# EAGLE design Main_bord (EAGLE 8.6.0)
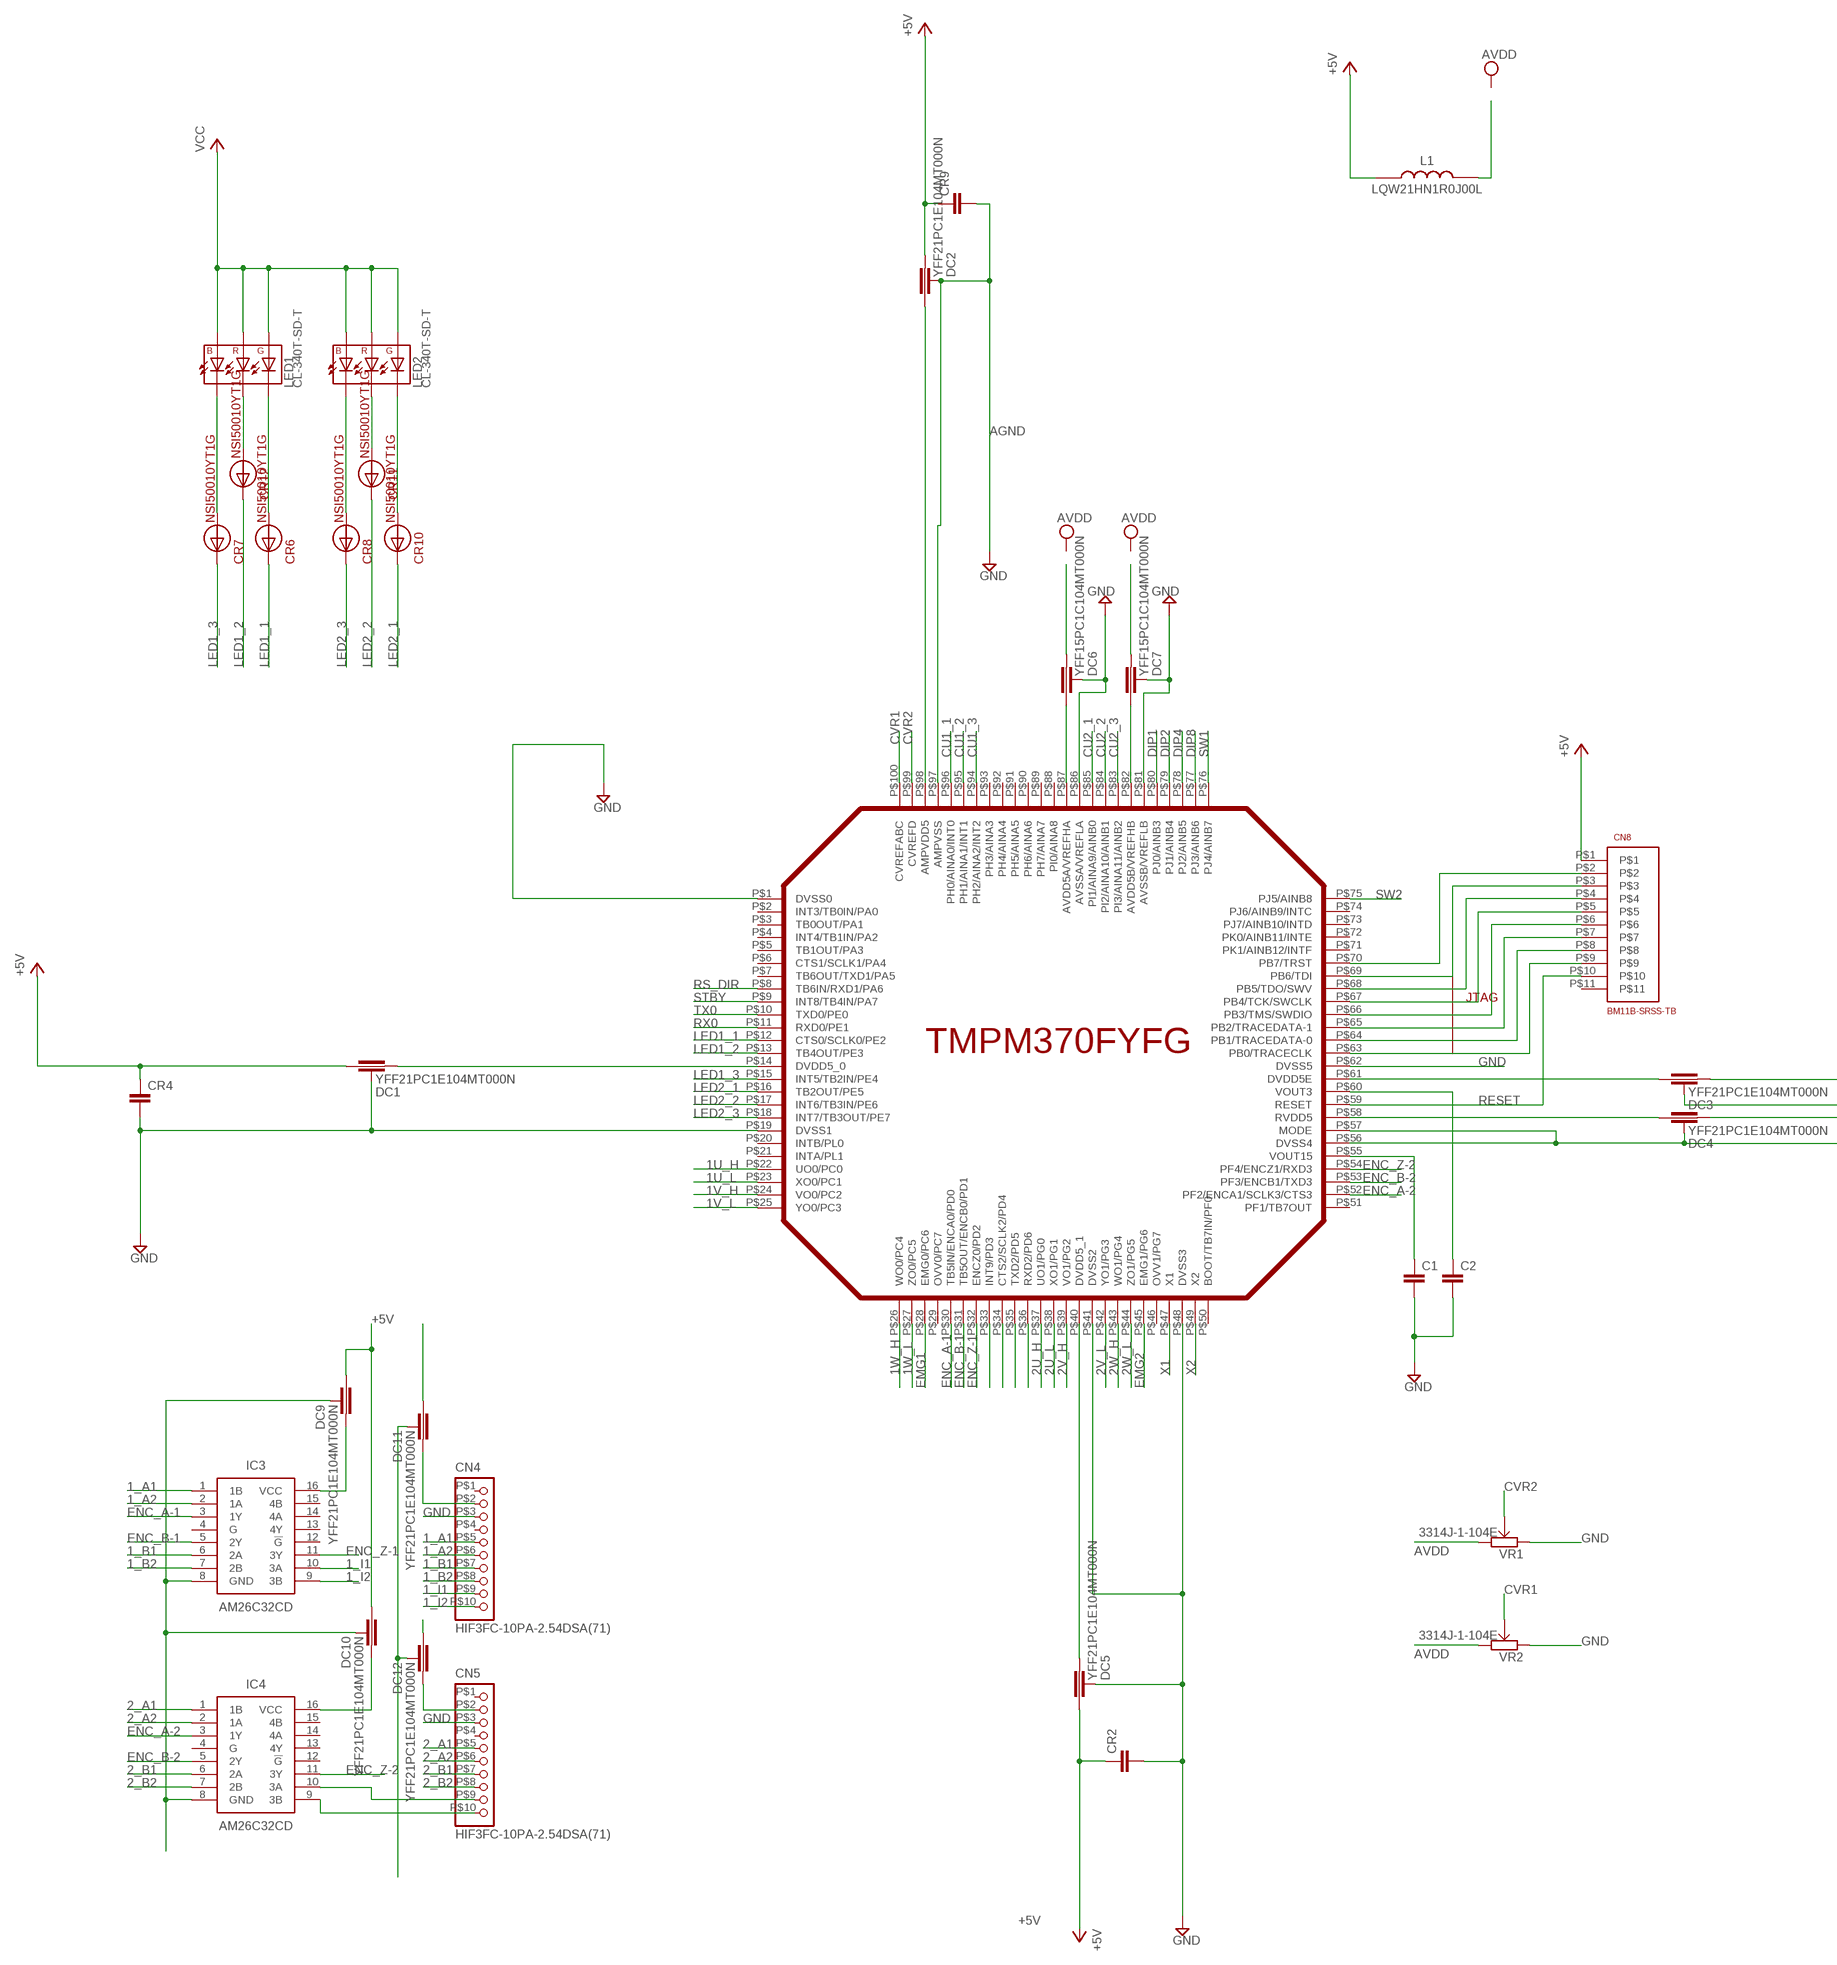
[diagram p0: schematic, sheet 1, part 1 of 2]
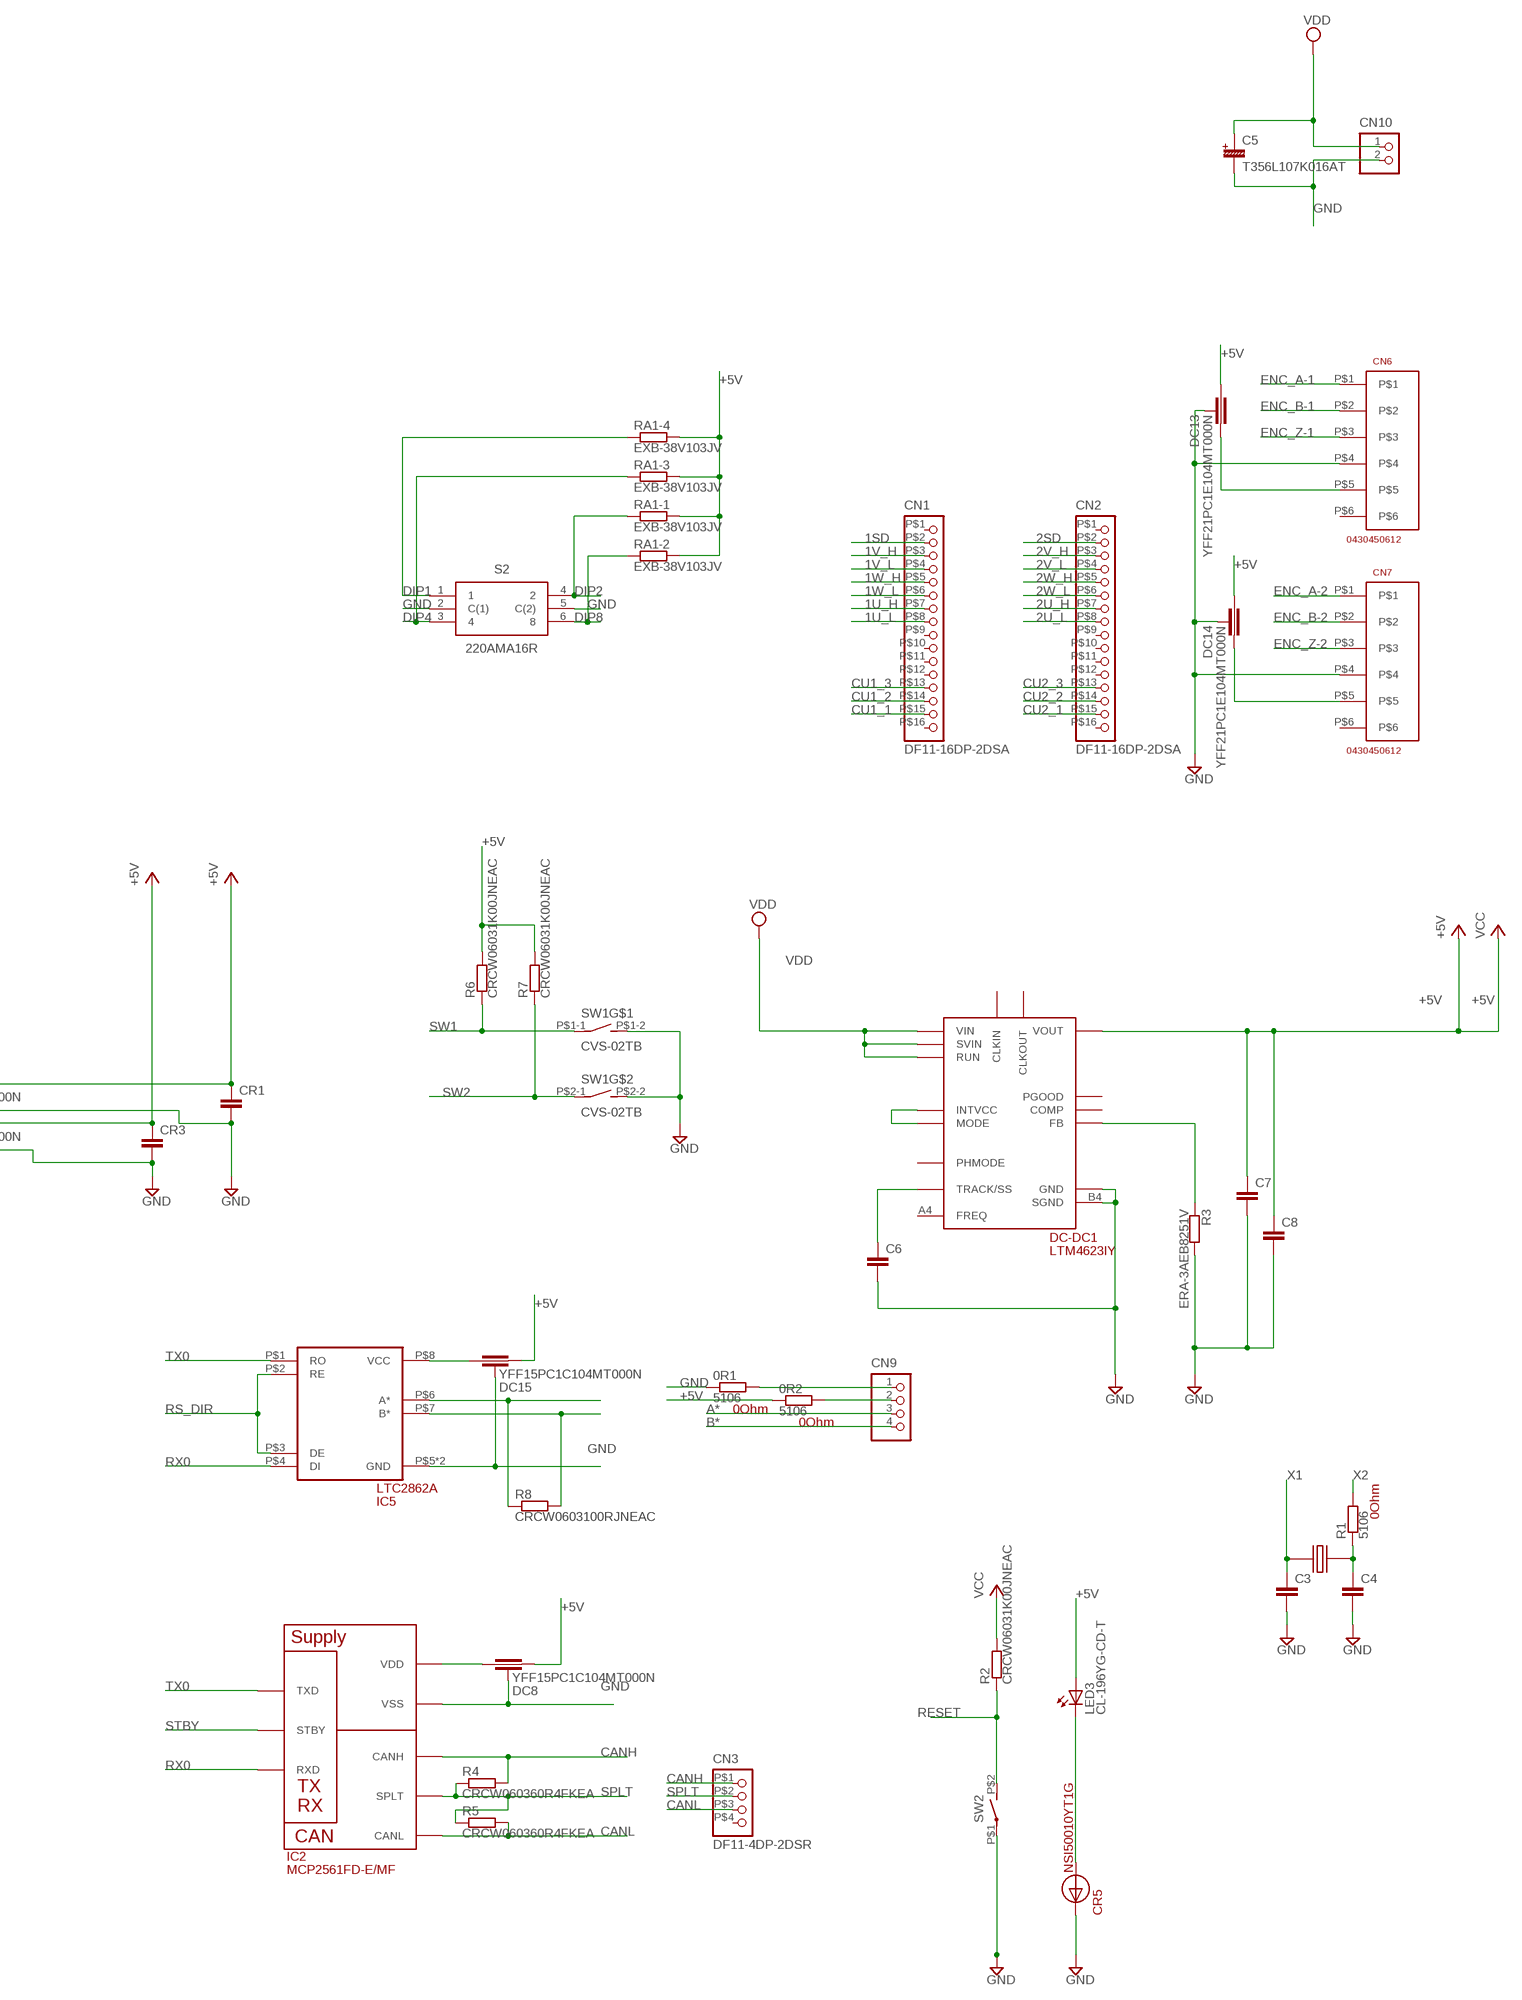
[diagram p1: schematic, sheet 1, part 2 of 2]

## Parts
0R1  5106  [5106JUMP_0805]
0R2  5106  [5106JUMP_0805]
C1  C2012X7R1A475M125AC  [C2012]
C2  C2012X7R1A475M125AC  [C2012]
C3  CGA1A2C0G1E180J030BA  [CC0603]
C4  CGA1A2C0G1E180J030BA  [CC0603]
C5  T356L107K016AT  [T356]
C6  CGA3E2X7R1H104K080AA  [0603]
C7  C2012JB0J476M125AC  [C2012]
C8  C2012JB0J476M125AC  [C2012]
CN1  DF11-16DP-2DSA  [DF11-16DP-2D]
CN2  DF11-16DP-2DSA  [DF11-16DP-2D]
CN3  DF11-4DP-2DSR  [DF11_4DP-2D]
CN4  HIF3FC-10PA-2.54DSA(71)  [HIF3FC-10PA]
CN5  HIF3FC-10PA-2.54DSA(71)  [HIF3FC-10PA]
CN6  0430450612  [0430450612]
CN7  0430450612  [0430450612]
CN8  BM11B-SRSS-TB  [BM11B-SRSS-TB]
CN9  B4B-XH-A  [B4B-XH-A]
CN10  B2B-XH-A  [B2B-XH-A]
CR1  C0816X7R1  [C0816]
CR2  C0816X7R1  [C0816]
CR3  C0816X7R1  [C0816]
CR4  C0816X7R1  [C0816]
CR5  NSI50010YT1G  [SOD-123]
CR6  NSI50010YT1G  [SOD-123]
CR7  NSI50010YT1G  [SOD-123]
CR8  NSI50010YT1G  [SOD-123]
CR9  C0816X7R1  [C0816]
CR10  NSI50010YT1G  [SOD-123]
CR11  NSI50010YT1G  [SOD-123]
CR12  NSI50010YT1G  [SOD-123]
DC1  YFF21PC1E104MT000N  [YFF21PC]
DC2  YFF21PC1E104MT000N  [YFF21PC]
DC3  YFF21PC1E104MT000N  [YFF21PC]
DC4  YFF21PC1E104MT000N  [YFF21PC]
DC5  YFF21PC1E104MT000N  [YFF21PC]
DC6  YFF15PC1C104MT000N  [YFF15PC]
DC7  YFF15PC1C104MT000N  [YFF15PC]
DC8  YFF15PC1C104MT000N  [YFF15PC]
DC9  YFF21PC1E104MT000N  [YFF21PC]
DC10  YFF21PC1E104MT000N  [YFF21PC]
DC11  YFF21PC1E104MT000N  [YFF21PC]
DC12  YFF21PC1E104MT000N  [YFF21PC]
DC13  YFF21PC1E104MT000N  [YFF21PC]
DC14  YFF21PC1E104MT000N  [YFF21PC]
DC15  YFF15PC1C104MT000N  [YFF15PC]
DC-DC1  LTM4623IY  [LGA-25_STD]
IC1  TMPM370FYFG  [LQFP100-P-1414-0.50H]
IC2  MCP2561FD-E/MF  [8-DFN]
IC3  AM26C32CD  [SOIC127P600X175-16N]
IC4  AM26C32CD  [SOIC127P600X175-16N]
IC5  LTC2862A  [DD_PACKGE_8]
L1  LQW21HN1R0J00L  [INDC2012X100N]
LED1  CL-340T-SD-T  [CL-340]
LED2  CL-340T-SD-T  [CL-340]
LED3  CL-196YG-CD-T  [CL-196]
R1  5106  [5106JUMP_0805]
R2  CRCW06031K00JNEAC  [0603]
R3  ERA-3AEB8251V  [0603]
R4  CRCW060360R4FKEA  [0603]
R5  CRCW060360R4FKEA  [0603]
R6  CRCW06031K00JNEAC  [0603]
R7  CRCW06031K00JNEAC  [0603]
R8  CRCW0603100RJNEAC  [0603]
RA1  EXB-38V103JV  [EXB-38V,28V]
S2  220AMA16R  [220AMA16R]
SW1  CVS-02TB  [CVS-02B]
SW2  EVQ-PE104K  [EVQ]
VR1  3314J-1-104E  [3314J-1]
VR2  3314J-1-104E  [3314J-1]
XTAL1  HCM4910000000ABJT  [HCM49]

## Nets
1_A1: CN4.P$5 IC3.1(1B)
1_A2: CN4.P$6 IC3.2(1A)
1_B1: CN4.P$7 IC3.6(2A)
1_B2: CN4.P$8 IC3.7(2B)
1_I1: CN4.P$9 IC3.10(3A)
1_I2: CN4.P$10 IC3.9(3B)
1SD: CN1.P$2
1U_H: CN1.P$7 IC1.P$22(UO0/PC0)
1U_L: CN1.P$8 IC1.P$23(XO0/PC1)
1V_H: CN1.P$3 IC1.P$24(VO0/PC2)
1V_L: CN1.P$4 IC1.P$25(YO0/PC3)
1W_H: CN1.P$5 IC1.P$26(WO0/PC4)
1W_L: CN1.P$6 IC1.P$27(ZO0/PC5)
2_A1: CN5.P$5 IC4.1(1B)
2_A2: CN5.P$6 IC4.2(1A)
2_B1: CN5.P$7 IC4.6(2A)
2_B2: CN5.P$8 IC4.7(2B)
2SD: CN2.P$2
2U_H: CN2.P$7 IC1.P$37(UO1/PG0)
2U_L: CN2.P$8 IC1.P$38(XO1/PG1)
2V_H: CN2.P$3 IC1.P$39(VO1/PG2)
2V_L: CN2.P$4 IC1.P$42(YO1/PG3)
2W_H: CN2.P$5 IC1.P$43(WO1/PG4)
2W_L: CN2.P$6 IC1.P$44(ZO1/PG5)
+5V: 0R2.P$2 C7.P$1 C8.P$1 CN8.P$1 CR1.P$1 CR2.P$1 CR3.P$1 CR4.P$1 CR9.P$1 DC1.P$1 DC2.P$2 DC3.P$2 DC4.P$2 DC5.P$1 DC8.P$2 DC9.P$1 DC10.P$1 DC11.P$1 DC12.P$1 DC13.P$1 DC14.P$1 DC15.P$2 DC-DC1.C1(VOUT) DC-DC1.D1(VOUT) DC-DC1.D2(VOUT) DC-DC1.E1(VOUT) DC-DC1.E2(VOUT) L1.1 LED1.P$1(A_G) LED1.P$2(R_A) LED1.P$3(B_A) LED2.P$1(A_G) LED2.P$2(R_A) LED2.P$3(B_A) LED3.P$A(A) R6.P$1 R7.P$1 RA1.P$1 RA1.P$2 RA1.P$3 RA1.P$4 ; supply symbol labelled VCC
A*: CN9.3 IC5.P$6(A*) R8.P$2
AGND: CR9.P$2 DC2.GND1(GND) DC2.GND2(GND) IC1.P$97(AMPVSS) ; supply symbol labelled GND
AVDD: DC6.P$2 DC7.P$2 L1.2 VR1.P$1 VR2.P$1
B*: CN9.4 IC5.P$7(B*) R8.P$1
CANH: CN3.P$1 IC2.P$7(CANH) R4.P$1
CANL: CN3.P$3 IC2.P$6(CANL) R5.P$1
CU1_1: CN1.P$15 IC1.P$96(PH0/AINA0/INT0)
CU1_2: CN1.P$14 IC1.P$95(PH1/AINA1/INT1)
CU1_3: CN1.P$13 IC1.P$94(PH2/AINA2/INT2)
CU2_1: CN2.P$15 IC1.P$85(PI1/AINA9/AINB0)
CU2_2: CN2.P$14 IC1.P$84(PI2/AINA10/AINB1)
CU2_3: CN2.P$13 IC1.P$83(PI3/AINA11/AINB2)
CVR1: IC1.P$100(CVREFABC) VR2.P$2(IO3)
CVR2: IC1.P$99(CVREFD) VR1.P$2(IO3)
DIP1: IC1.P$80(PJ0/AINB3) RA1.P$5 S2.1
DIP2: IC1.P$79(PJ1/AINB4) RA1.P$8 S2.4
DIP4: IC1.P$78(PJ2/AINB5) RA1.P$6 S2.3
DIP8: IC1.P$77(PJ3/AINB6) RA1.P$7 S2.6
EMG1: IC1.P$28(EMG0/PC6)
EMG2: IC1.P$45(EMG1/PG6)
ENC_A-1: CN6.P$1 IC1.P$30(TB5IN/ENCA0/PD0) IC3.3(1Y)
ENC_A-2: CN7.P$1 IC1.P$52(PF2/ENCA1/SCLK3/CTS3) IC4.3(1Y)
ENC_B-1: CN6.P$2 IC1.P$31(TB5OUT/ENCB0/PD1) IC3.5(2Y)
ENC_B-2: CN7.P$2 IC1.P$53(PF3/ENCB1/TXD3) IC4.5(2Y)
ENC_Z-1: CN6.P$3 IC1.P$32(ENCZ0/PD2) IC3.11(3Y)
ENC_Z-2: CN7.P$3 IC1.P$54(PF4/ENCZ1/RXD3) IC4.11(3Y)
GND: 0R1.P$2 C1.P$2 C2.P$2 C3.P$2 C4.P$2 C5.P$- C6.P$2 C7.P$2 C8.P$2 CN4.P$3 CN5.P$3 CN6.P$4 CN7.P$4 CN10.2 CR1.P$2 CR2.P$2 CR3.P$2 CR4.P$2 CR5.P$C DC1.GND1(GND) DC1.GND2(GND) DC3.GND1(GND) DC3.GND2(GND) DC4.GND1(GND) DC4.GND2(GND) DC5.GND1(GND) DC5.GND2(GND) DC6.P$3(GND) DC6.P$4(GND) DC7.P$3(GND) DC7.P$4(GND) DC8.P$3(GND) DC8.P$4(GND) DC9.GND1(GND) DC9.GND2(GND) DC10.GND1(GND) DC10.GND2(GND) DC11.GND1(GND) DC11.GND2(GND) DC12.GND1(GND) DC12.GND2(GND) DC13.GND1(GND) DC13.GND2(GND) DC14.GND1(GND) DC14.GND2(GND) DC15.P$3(GND) DC15.P$4(GND) DC-DC1.B3(GND) DC-DC1.B4(SGND) DC-DC1.C3(GND) DC-DC1.D3(GND) DC-DC1.D4(GND) DC-DC1.E3(GND) IC1.P$19(DVSS1) IC1.P$41(DVSS2) IC1.P$48(DVSS3) IC1.P$56(DVSS4) IC1.P$57(MODE) IC1.P$62(DVSS5) IC1.P$81(AVSSB/VREFLB) IC1.P$86(AVSSA/VREFLA) IC2.P$2(VSS) IC2.P$9(VSS) IC3.8(GND) IC4.8(GND) IC5.P$5(GND) IC5.PAD(GND) R3.P$1 S2.2(C(1)) S2.5(C(2)) SW1.P$1-2(S) SW1.P$2-2(S) SW2.P$1(P) VR1.P$3 VR2.P$3
LED1_1: CR6.P$C IC1.P$12(CTS0/SCLK0/PE2)
LED1_2: CR12.P$C IC1.P$13(TB4OUT/PE3)
LED1_3: CR7.P$C IC1.P$15(INT5/TB2IN/PE4)
LED2_1: CR10.P$C IC1.P$16(TB2OUT/PE5)
LED2_2: CR11.P$C IC1.P$17(INT6/TB3IN/PE6)
LED2_3: CR8.P$C IC1.P$18(INT7/TB3OUT/PE7)
N$1: DC5.P$2 IC1.P$40(DVDD5_1)
N$2: DC4.P$1 IC1.P$58(RVDD5)
N$3: DC3.P$1 IC1.P$61(DVDD5E)
N$4: DC2.P$1 IC1.P$98(AMPVDD5)
N$5: DC1.P$2 IC1.P$14(DVDD5_0)
N$6: DC8.P$1 IC2.P$3(VDD)
N$7: DC-DC1.B1(FB) R3.P$2
N$8: C1.P$1 IC1.P$55(VOUT15)
N$9: C2.P$1 IC1.P$60(VOUT3)
N$11: C4.P$1 R1.P$2 XTAL1.P$2
N$12: C6.P$1 DC-DC1.A2(TRACK/SS)
N$13: IC1.P$36(RXD2/PD6)
N$14: DC6.P$1 IC1.P$87(AVDD5A/VREFHA)
N$15: DC7.P$1 IC1.P$82(AVDD5B/VREFHB)
N$16: IC1.P$1(DVSS0)
N$17: IC1.P$35(TXD2/PD5)
N$18: CN8.P$5 IC1.P$67(PB4/TCK/SWCLK)
N$19: CN8.P$6 IC1.P$66(PB3/TMS/SWDIO)
N$20: CN8.P$9 IC1.P$63(PB0/TRACECLK)
N$21: CN8.P$7 IC1.P$65(PB2/TRACEDATA-1)
N$22: CN8.P$8 IC1.P$64(PB1/TRACEDATA-0)
N$23: CN8.P$4 IC1.P$68(PB5/TDO/SWV)
N$24: CN8.P$3 IC1.P$69(PB6/TDI)
N$25: CN8.P$2 IC1.P$70(PB7/TRST)
N$26: IC1.P$34(CTS2/SCLK2/PD4)
N$27: IC1.P$33(INT9/PD3)
N$28: DC10.P$2 IC4.16(VCC)
N$29: DC9.P$2 IC3.16(VCC)
N$30: CN5.P$2 DC12.P$2
N$31: CN4.P$2 DC11.P$2
N$32: CN6.P$5 DC13.P$2
N$33: CN7.P$5 DC14.P$2
N$34: CR5.P$A LED3.P$C(C)
N$35: CN5.P$9 IC4.10(3A)
N$36: CN5.P$10 IC4.9(3B)
N$37: CR7.P$A LED1.P$4(B_C)
N$38: CR12.P$A LED1.P$5(R_C)
N$39: CR6.P$A LED1.P$6(G_C)
N$40: CR8.P$A LED2.P$4(B_C)
N$41: CR11.P$A LED2.P$5(R_C)
N$42: CR10.P$A LED2.P$6(G_C)
N$43: DC15.P$1 IC5.P$8(VCC)
N$44: 0R2.P$1 CN9.2
N$45: DC-DC1.C4(MODE) DC-DC1.E4(INTVCC)
N$46: 0R1.P$1 CN9.1
RESET: CN8.P$10 IC1.P$59(RESET) R2.P$2 SW2.P$2(S)
RS_DIR: IC1.P$8(TB6IN/RXD1/PA6) IC5.P$2(RE) IC5.P$3(DE)
RX0: IC1.P$11(RXD0/PE1) IC2.P$4(RXD) IC5.P$4(DI)
SPLT: CN3.P$2 IC2.P$5(SPLT) R4.P$2 R5.P$2
STBY: IC1.P$9(INT8/TB4IN/PA7) IC2.P$8(STBY)
SW1: IC1.P$76(PJ4/AINB7) R6.P$2 SW1.P$1-1(P)
SW2: IC1.P$75(PJ5/AINB8) R7.P$2 SW1.P$2-1(P)
TX0: IC1.P$10(TXD0/PE0) IC2.P$1(TXD) IC5.P$1(RO)
VCC: R2.P$1
VDD: C5.P$+(+) CN10.1 DC-DC1.A3(RUN) DC-DC1.C5(SVIN) DC-DC1.D5(VIN) DC-DC1.E5(VIN)
X1: C3.P$1 IC1.P$47(X1) XTAL1.P$1
X2: IC1.P$49(X2) R1.P$1
Unconnected: CN1.P$1 CN1.P$9 CN1.P$10 CN1.P$11 CN1.P$12 CN1.P$16 CN2.P$1 CN2.P$9 CN2.P$10 CN2.P$11 CN2.P$12 CN2.P$16 CN3.P$4 CN4.P$1 CN4.P$4 CN5.P$1 CN5.P$4 CN6.P$6 CN7.P$6 CN8.P$11 DC-DC1.A1(COMP) DC-DC1.A4(FREQ) DC-DC1.A5(CLKIN) DC-DC1.B2(PHMODE) DC-DC1.B5(CLKOUT) DC-DC1.C2(PGOOD) IC1.P$2(INT3/TB0IN/PA0) IC1.P$3(TB0OUT/PA1) IC1.P$4(INT4/TB1IN/PA2) IC1.P$5(TB1OUT/PA3) IC1.P$6(CTS1/SCLK1/PA4) IC1.P$7(TB6OUT/TXD1/PA5) IC1.P$20(INTB/PL0) IC1.P$21(INTA/PL1) IC1.P$29(OVV0/PC7) IC1.P$46(OVV1/PG7) IC1.P$50(BOOT/TB7IN/PF0) IC1.P$51(PF1/TB7OUT) IC1.P$71(PK1/AINB12/INTF) IC1.P$72(PK0/AINB11/INTE) IC1.P$73(PJ7/AINB10/INTD) IC1.P$74(PJ6/AINB9/INTC) IC1.P$88(PI0/AINA8) IC1.P$89(PH7/AINA7) IC1.P$90(PH6/AINA6) IC1.P$91(PH5/AINA5) IC1.P$92(PH4/AINA4) IC1.P$93(PH3/AINA3) IC3.4(G) IC3.12(!G) IC3.13(4Y) IC3.14(4A) IC3.15(4B) IC4.4(G) IC4.12(!G) IC4.13(4Y) IC4.14(4A) IC4.15(4B)

## Notes on the sheet
- JTAG

## Library data of the parts
0R1 0R2 R1 = Keystone:5106: 0 Ohms ジャンパ 0.5W、1/2W チップ抵抗 0805（2012メートル法） 金属素子
C1 C2 = TDK:C2012X7R1A475M125AC: 4.7µF ±20% 10V セラミックコンデンサ X7R 0805
C3 C4 = TDK:CGA1A2C0G1E180J030BA: 18pF ±5% 25V セラミックコンデンサ C0G、NP0 0201（0603メートル法）
C5 = KEMET:T356L107K016AT: 100µF 絶縁保護加工 タンタルコンデンサ 16V ラジアル 800ミリオーム
C6 = TDK:CGA3E2X7R1H104K080AA: 0.1µF ±10% 50V セラミックコンデンサ X7R 0603（1608メートル法）
C7 C8 = TDK:C2012JB0J476M125AC: 47µF ±20% 6.3V セラミックコンデンサ JB 0805
CN1 CN2 = Hirose:DF11-16DP-2DSA
CN3 = Hirose:DF11-4DP-2DSR
CN4 CN5 = Hirose:HIF3FC-10PA-2.54DSA(71): 10 ポジション ヘッダ コネクタ 0.100インチ（2.54mm） スルーホール 金
CN6 CN7 = Molex:0430450612: 6 ポジション ヘッダ コネクタ 0.118インチ（3.00mm） スルーホール 錫
CN8 = JST:BM11B-SRSS-TB
CN9 = jst-xh:B4B-XH-A: Wire-to-Board 2.5mm pitch top mount connector Source: http://www.jst-mfg.com/product/pdf/jpn/XH.pdf http://www.jst-mfg.com/product/detail.php?series=277
CN10 = jst-xh:B2B-XH-A: Wire-to-Board 2.5mm pitch top mount connector Source: http://www.jst-mfg.com/product/pdf/jpn/XH.pdf http://www.jst-mfg.com/product/detail.php?series=277
CR1-CR4 CR9 = TDK:C0816X7R1: 0.1µF ±20% 16V セラミックコンデンサ X7R 0306 LW逆転
CR5-CR8 CR10-CR12 = ON Semiconductor:NSI50010YT1G: Current Regulator Regulator High/Low-Side 10mA SOD-123
DC1-DC5 DC9-DC14 = TDK:YFF21PC1E104MT000N: 0.1µF Feed Through Capacitor 25V 2A 80 mOhm 0805 (2012 Metric), 4 PC Pad
DC6-DC8 DC15 = TDK:YFF15PC1C104MT000N: 0.1µF Feed Through Capacitor 16V 3A 30 mOhm 0402 (1005 Metric), 4 PC Pad
DC-DC1 = LT:LTM4623IY: 非絶縁PoLモジュール DC/DCコンバータ 1 出力 0.6～5.5 V 3A 4V 20V 入力
IC1 = TOSHIBA:TMPM370FYFG
IC2 = MicroChip:MCP2561FD-E/MF: 1/1 トランシーバ CAN 8-DFN（3x3） SPLT端子有り
IC3 IC4 = AM26C32CD:AM26C32CD: AM26C32CD, Quad Line Receiver, RS-422, V.11 10Mbit/s Differential 5V 16-Pin SOIC <https://componentsearchengine.com/Images/3/AM26C32CD.gif> Source: Datasheet <http://www.ti.com/lit/ds/symlink/am26c32.pdf>; DESCRIPTION: AM26C32CD, Quad Line Receiver, RS-422, V.11 10Mbit/s Differential 5V 16-Pin SOIC; HEIGHT: 1.75mm; MANUFACTURER_NAME: Texas Instruments; MANUFACTURER_PART_NUMBER: AM26C32CD; RS_PART_NUMBER: 5170542; SUPPLIER_NAME: RS
IC5 = LT:LTC2862A
L1 = LQW21HN1R0J00L:LQW21HN1R0J00L: Murata LQW21H Series Wire-wound SMD Inductor with a Ferrite Core, 1.0 H 5% 115mA Idc Q:35 <http://uk.rs-online.com/largeimages/R7242898-01.jpg> Source: Datasheet <https://componentsearchengine.com/Datasheets/1/LQW21HN1R0J00L.pdf>; DESCRIPTION: Murata LQW21H Series Wire-wound SMD Inductor with a Ferrite Core, 1.0 H 5% 115mA Idc Q:35; HEIGHT: 1mm; MANUFACTURER_NAME: Murata Electronics; MANUFACTURER_PART_NUMBER: LQW21HN1R0J00L; RS_PART_NUMBER: 7855321; SUPPLIER_NAME: RS
LED1 LED2 = Citizen:CL-340T-SD-T: 赤、緑、青（RGB） 618nm赤、530nm緑、470nm青 LED表示 - ディスクリート 1.85V赤、2.7V緑、2.75V青 5-SMD、リードなし
LED3 = Citizen:CL-196YG-CD-T: 緑 575nm LED表示 - ディスクリート 2.2V 0603（1608メートル法）
R2 R6 R7 = VISHAY:CRCW06031K00JNEAC: 1 kOhms ±5% 0.1W、1/10W チップ抵抗 0603（1608メートル法） 厚膜
R3 = Panasonic:ERA-3AEB8251V: 8.25 kOhms ±0.1% 0.1W、1/10W チップ抵抗 0603（1608メートル法） 車載用AEC-Q200 薄膜
R4 R5 = VISHAY:CRCW060360R4FKEA: 60.4 Ohms ±1% 0.1W、1/10W チップ抵抗 0603（1608メートル法） 車載用AEC-Q200 厚膜
R8 = VISHAY:CRCW0603100RJNEAC: 100 Ohms ±5% 0.1W、1/10W チップ抵抗 0603（1608メートル法） 厚膜
RA1 = Pana_Chip_RA:EXB-38V103JV
S2 = 220AMA16R:220AMA16R: 16-pos,flush act,SMD,rotary coded 16 Way Surface Mount Rotary Switch SPST <https://componentsearchengine.com/Images/1/220AMA16R.jpg> Source: Datasheet <https://www.ctscorp.com/wp-content/uploads/220.pdf>; DESCRIPTION: 16-pos,flush act,SMD,rotary coded 16 Way Surface Mount Rotary Switch SPST; HEIGHT: 3mm; MANUFACTURER_NAME: CTS; MANUFACTURER_PART_NUMBER: 220AMA16R; RS_PART_NUMBER: 1234577; SUPPLIER_NAME: RS
SW1 = Nidec:CVS-02TB: Dip Switch SPST 2 Position Surface Mount Slide (Standard) Actuator 100mA 6VDC
SW2 = Panasonic:EVQ-PE104K: Tactile Switch SPST-NO Top Actuated Surface Mount
VR1 VR2 = Bourns:3314J-1-104E: 100 kOhms 0.25W, 1/4W J Lead Surface Mount Trimmer Potentiometer Cermet 1 Turn Top Adjustment
XTAL1 = Citizen:HCM4910000000ABJT

## Board
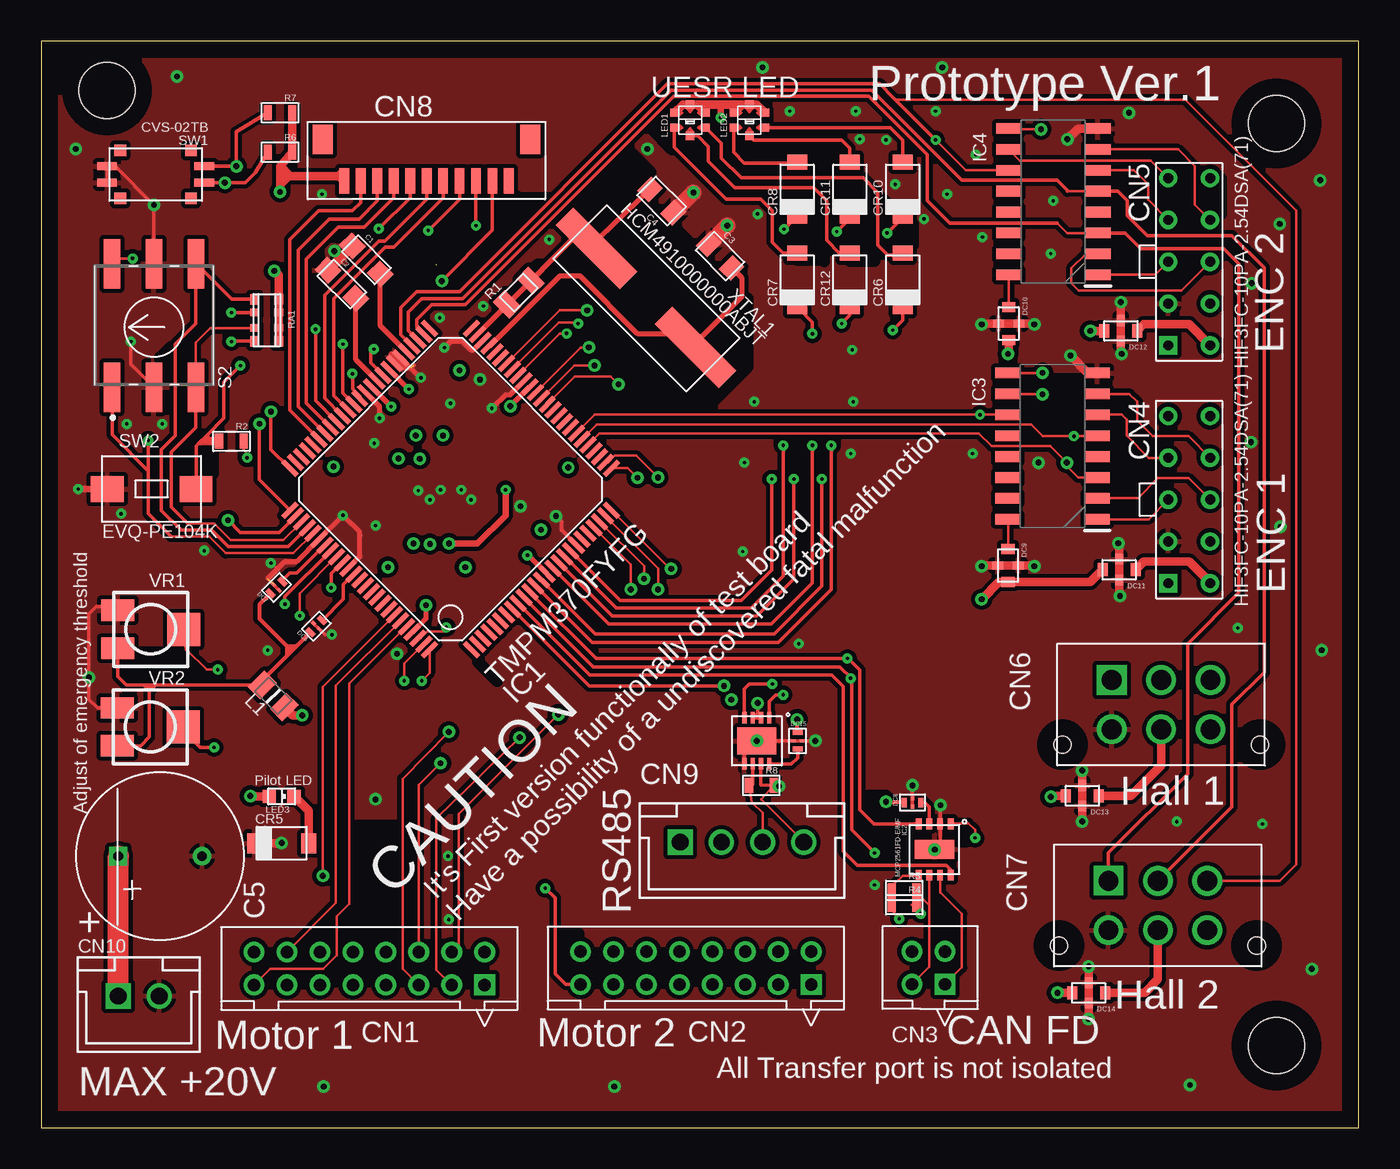
[diagram p2: board, top side]
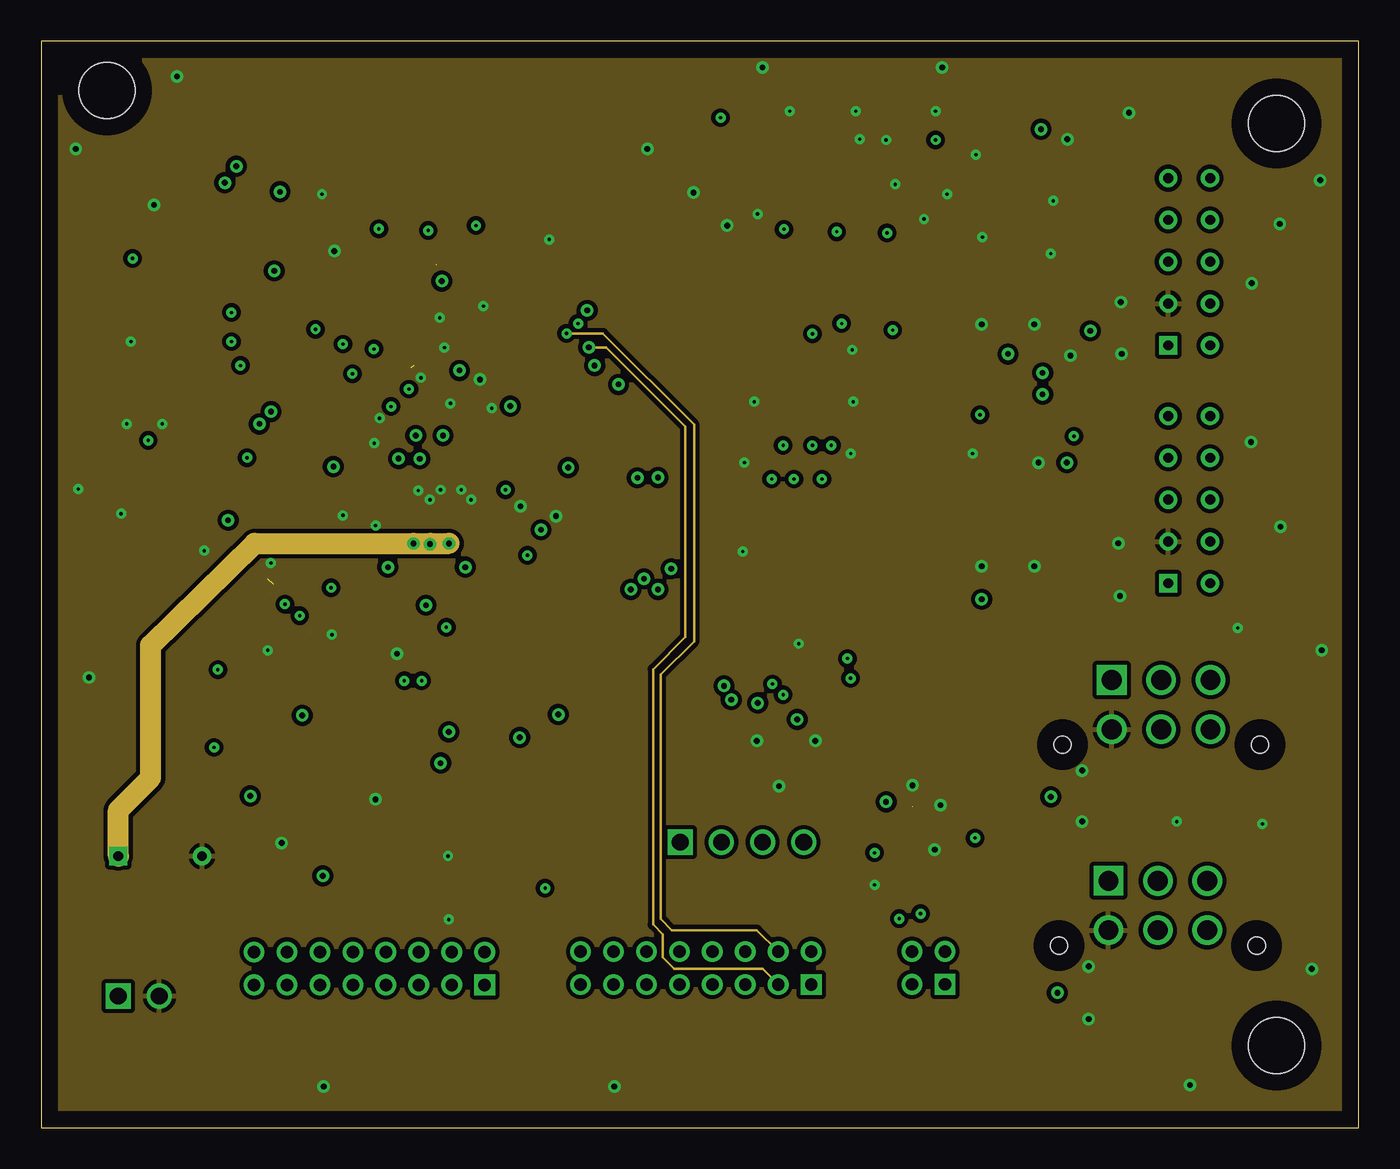
[diagram p3: board, inner layer Route2]
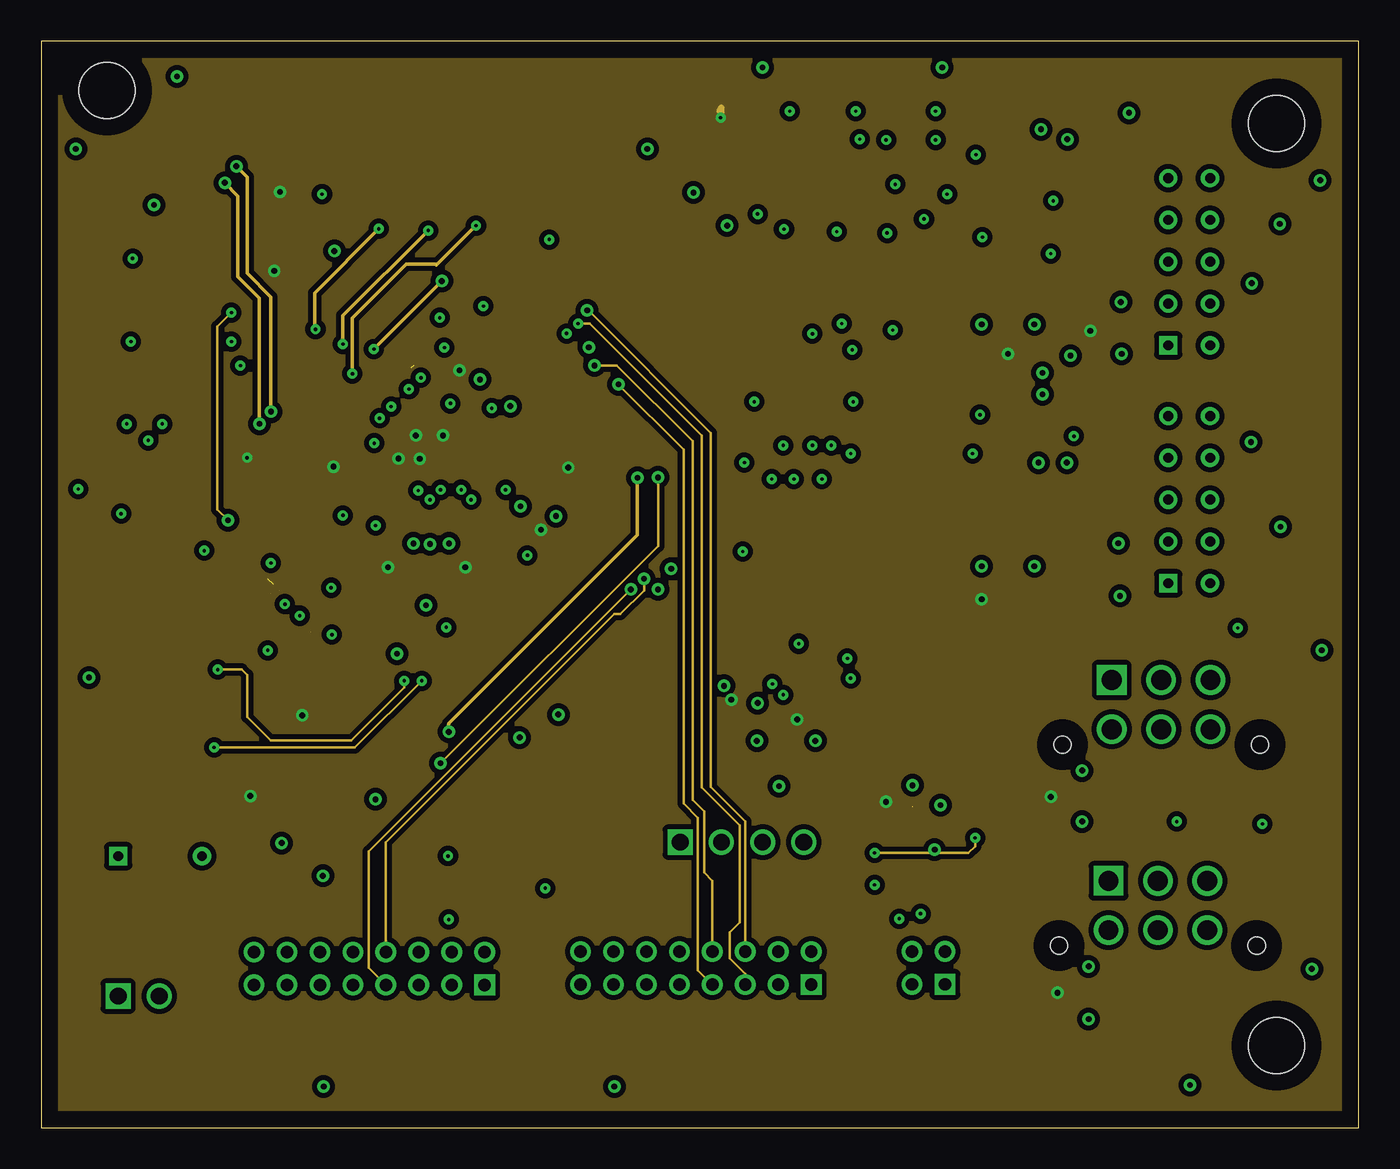
[diagram p4: board, inner layer Route3]
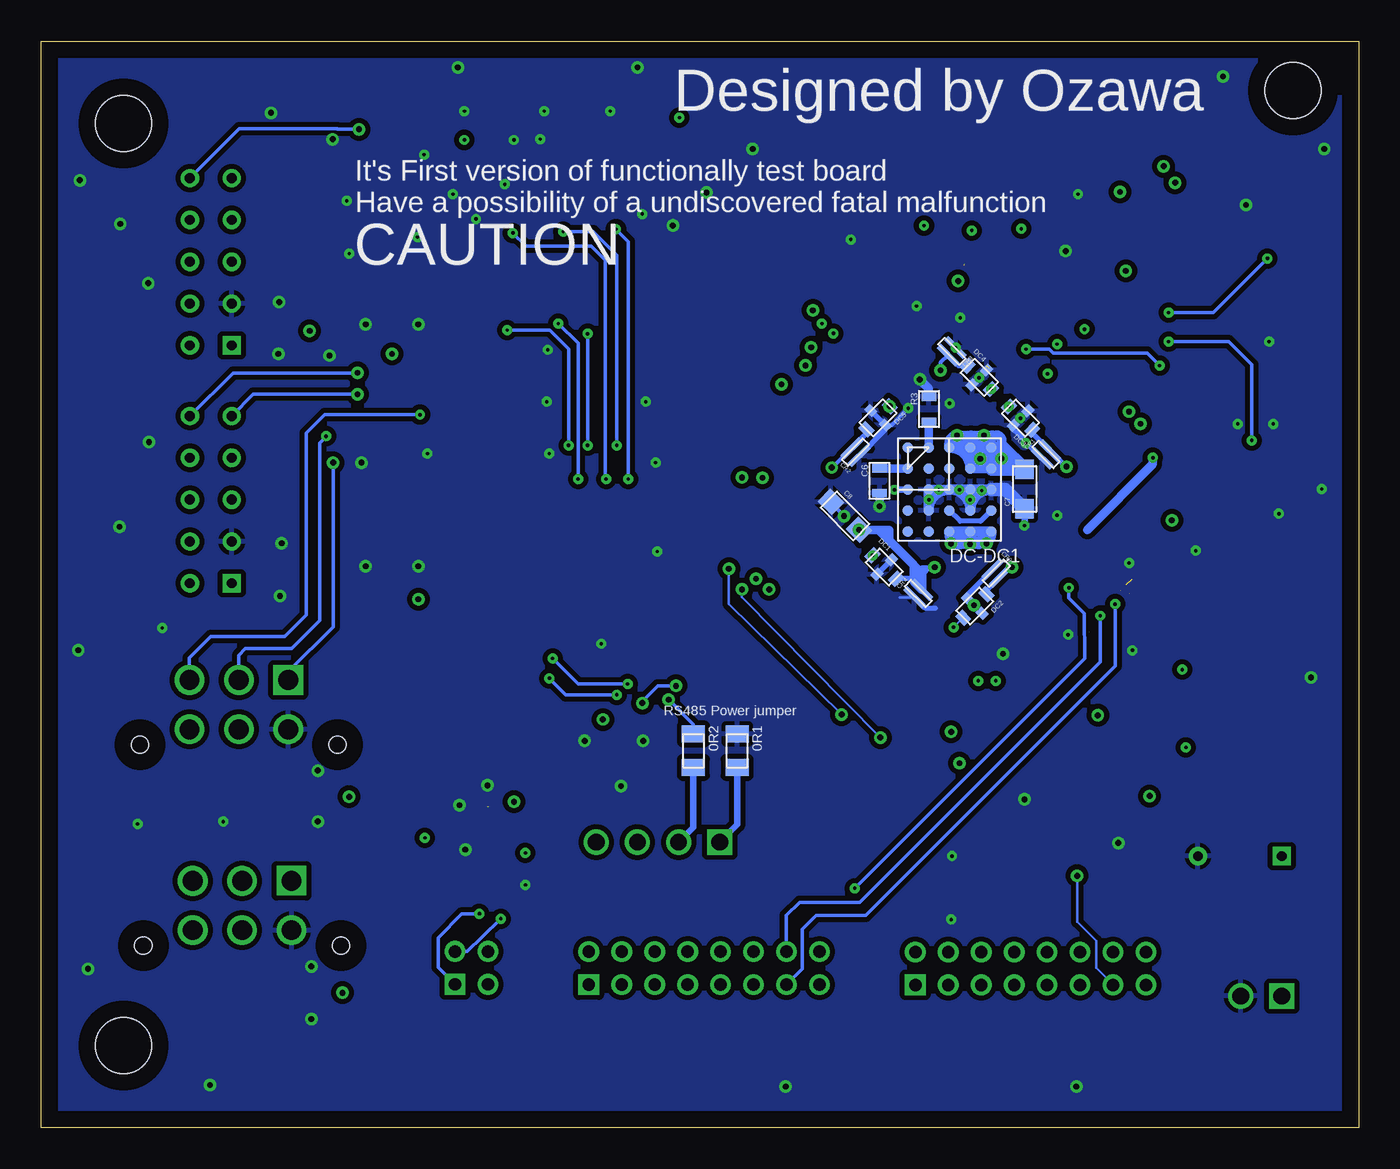
[diagram p5: board, bottom side, seen from below]

Size 80 x 66 mm. Coordinates in mm from the lower left corner, seen from the top.
Outline: 0,0 80,0 80,66 0,66 0,0
Copper layers (1*2+3*16): Top 0.035mm / dielectric 1.5mm / Route2 0.035mm / dielectric 0.15mm / Route3 0.035mm / dielectric 0.2mm / Bottom 0.035mm
Design rules "default *": minimum track width 6mil, minimum drill 0.35mm, track to track 6mil, track to pad 6mil, pad to pad 6mil, via to via 6mil, smd to smd 6mil, copper to edge 40mil, drill to drill 6mil, minimum pad ring 10mil, minimum via ring 8mil, stop-mask expansion 4mil, vias tented up to drill 0mil, thermal gap 10mil
Holes 3.4 mm at 4,63 75,61 75,5
tRestrict: area 28.6,43.8 to 42.9,58.4; area 28.6,49.8 to 31.2,52.5; area 26.5,27.1 to 27.7,28.3; area 13.6,38.2 to 15.6,40.9; area 49.5,16.4 to 52.8,18.9; area 50,18.8 to 53,20.2; area 55.5,17.4 to 56.2,18.2; area 31.6,9.1 to 32.7,11.8; area 18.2,10.9 to 21.6,18.4; area 5.1,27.4 to 9.9,28.9; area 7.2,46.5 to 8,47.5; area 27.8,54.5 to 28.9,56.6; 12 more areas
vRestrict: area 26.6,44.5 to 43.2,58.3; area 28.4,43.8 to 41.4,47.7; area 28.4,44.6 to 41.4,50.9

### Footprints (pad centres in the part's own frame; a part is rotated, then mirrored left to right if it is on the bottom)
5106JUMP_0805 = smd 1.015 x 1.4: P$1 1.015,0; P$2 -1.015,0
C2012 = smd 1.2 x 1.1: P$1 0,0; P$2 2.4,0
CC0603 = smd 1 x 1.2: P$1 0,0; P$2 2,0
T356 = drill 0.6 square: P$+ -2.54,0 | drill 0.6: P$- 2.54,0
0603 = smd 0.5 x 0.9: P$1 -0.75,0; P$2 0.75,0
DF11-16DP-2D = drill 0.75 square: P$1 0,0 | drill 0.75: P$2 0,2; P$3 -2,0; P$4 -2,2; P$5 -4,0; P$6 -4,2; P$7 -6,0; P$8 -6,2; P$9 -8,0; P$10 -8,2; P$11 -10,0; P$12 -10,2; P$13 -12,0; P$14 -12,2; P$15 -14,0; P$16 -14,2
DF11_4DP-2D = drill 0.75 square: P$1 0.97,-1.14 | drill 0.75: P$2 0.97,0.86; P$3 -1.03,-1.14; P$4 -1.03,0.86
HIF3FC-10PA = drill 0.6 square: P$1 -5.08,1.27 | drill 0.6: P$2 -5.08,-1.27; P$3 -2.54,1.27; P$4 -2.54,-1.27; P$5 0,1.27; P$6 0,-1.27; P$7 2.54,1.27; P$8 2.54,-1.27; P$9 5.08,1.27; P$10 5.08,-1.27
0430450612 = drill 1.2 square: P$1 3,-1.5 | drill 1.2: P$2 0,-1.5; P$3 -3,-1.5; P$4 3,1.5; P$5 0,1.5; P$6 -3,1.5 | hole 1.03: -6,2.44; 6,2.44
BM11B-SRSS-TB = smd 0.6 x 1.55: P$1 -5,0; P$2 -4,0; P$3 -3,0; P$4 -2,0; P$5 -1,0; P$6 0,0; P$7 1,0; P$8 2,0; P$9 3,0; P$10 4,0; P$11 5,0 | smd 1.2 x 1.8: P$12 -6.3,2.525; P$13 6.3,2.525
B4B-XH-A = drill 1.016 square: 1 -3.75,0 | drill 1.016: 2 -1.25,0; 3 1.25,0; 4 3.75,0
B2B-XH-A = drill 1.016 square: 1 -1.25,0 | drill 1.016: 2 1.25,0
C0816 = smd 0.35 x 1.6: P$1 0,0; P$2 0.65,0
SOD-123 = smd 0.91 x 1.22: P$A 1.635,0; P$C -1.635,0
YFF21PC = smd 0.5 x 0.65: GND1 0,0.625; GND2 0,-0.625 | smd 0.6 x 0.8: P$1 -1,0; P$2 1,0
YFF15PC = smd 0.3 x 0.6: P$1 -0.5,0; P$2 0.5,0 | smd 0.19 x 0.25: P$3 0,0.25; P$4 0,-0.25
LGA-25_STD = smd 0.635 x 0.635: A1 -2.54,2.54; A2 -2.54,1.27; A3 -2.54,0; A4 -2.54,-1.27; A5 -2.54,-2.54; B1 -1.27,2.54; B2 -1.27,1.27; B3 -1.27,0; B4 -1.27,-1.27; B5 -1.27,-2.54; C1 0,2.54; C2 0,1.27; C3 0,0; C4 0,-1.27; C5 0,-2.54; D1 1.27,2.54; D2 1.27,1.27; D3 1.27,0; D4 1.27,-1.27; D5 1.27,-2.54; E1 2.54,2.54; E2 2.54,1.27; E3 2.54,0; E4 2.54,-1.27; E5 2.54,-2.54
LQFP100-P-1414-0.50H = smd 0.3 x 1.2: P$1 -6,-7.8; P$2 -5.5,-7.8; P$3 -5,-7.8; P$4 -4.5,-7.8; P$5 -4,-7.8; P$6 -3.5,-7.8; P$7 -3,-7.8; P$8 -2.5,-7.8; P$9 -2,-7.8; P$10 -1.5,-7.8; P$11 -1,-7.8; P$12 -0.5,-7.8; P$13 0,-7.8; P$14 0.5,-7.8; P$15 1,-7.8; P$16 1.5,-7.8; P$17 2,-7.8; P$18 2.5,-7.8; P$19 3,-7.8; P$20 3.5,-7.8; P$21 4,-7.8; P$22 4.5,-7.8; P$23 5,-7.8; P$24 5.5,-7.8; P$25 6,-7.8; P$51 6,7.8; P$52 5.5,7.8; P$53 5,7.8; P$54 4.5,7.8; P$55 4,7.8; P$56 3.5,7.8; P$57 3,7.8; P$58 2.5,7.8; P$59 2,7.8; P$60 1.5,7.8; P$61 1,7.8; P$62 0.5,7.8; P$63 0,7.8; P$64 -0.5,7.8; P$65 -1,7.8; P$66 -1.5,7.8; P$67 -2,7.8; P$68 -2.5,7.8; P$69 -3,7.8; P$70 -3.5,7.8; P$71 -4,7.8; P$72 -4.5,7.8; P$73 -5,7.8; P$74 -5.5,7.8; P$75 -6,7.8 | smd 1.2 x 0.3: P$26 7.8,-6; P$27 7.8,-5.5; P$28 7.8,-5; P$29 7.8,-4.5; P$30 7.8,-4; P$31 7.8,-3.5; P$32 7.8,-3; P$33 7.8,-2.5; P$34 7.8,-2; P$35 7.8,-1.5; P$36 7.8,-1; P$37 7.8,-0.5; P$38 7.8,0; P$39 7.8,0.5; P$40 7.8,1; P$41 7.8,1.5; P$42 7.8,2; P$43 7.8,2.5; P$44 7.8,3; P$45 7.8,3.5; P$46 7.8,4; P$47 7.8,4.5; P$48 7.8,5; P$49 7.8,5.5; P$50 7.8,6; P$76 -7.8,6; P$77 -7.8,5.5; P$78 -7.8,5; P$79 -7.8,4.5; P$80 -7.8,4; P$81 -7.8,3.5; P$82 -7.8,3; P$83 -7.8,2.5; P$84 -7.8,2; P$85 -7.8,1.5; P$86 -7.8,1; P$87 -7.8,0.5; P$88 -7.8,0; P$89 -7.8,-0.5; P$90 -7.8,-1; P$91 -7.8,-1.5; P$92 -7.8,-2; P$93 -7.8,-2.5; P$94 -7.8,-3; P$95 -7.8,-3.5; P$96 -7.8,-4; P$97 -7.8,-4.5; P$98 -7.8,-5; P$99 -7.8,-5.5; P$100 -7.8,-6
8-DFN = smd 0.35 x 0.65: P$1 -0.975,-1.55; P$2 -0.325,-1.55; P$3 0.325,-1.55; P$4 0.975,-1.55; P$5 0.975,1.55; P$6 0.325,1.55; P$7 -0.325,1.55; P$8 -0.975,1.55 | smd 2.4 x 1.15: P$9 0,0
SOIC127P600X175-16N = smd 1.525 x 0.65: 1 -2.712,4.445; 2 -2.712,3.175; 3 -2.712,1.905; 4 -2.712,0.635; 5 -2.712,-0.635; 6 -2.712,-1.905; 7 -2.712,-3.175; 8 -2.712,-4.445; 9 2.712,-4.445; 10 2.712,-3.175; 11 2.712,-1.905; 12 2.712,-0.635; 13 2.712,0.635; 14 2.712,1.905; 15 2.712,3.175; 16 2.712,4.445
DD_PACKGE_8 = smd 0.25 x 0.7: P$1 -0.75,-1.4; P$2 -0.25,-1.4; P$3 0.25,-1.4; P$4 0.75,-1.4; P$5 0.75,1.4; P$6 0.25,1.4; P$7 -0.25,1.4; P$8 -0.75,1.4 | smd 2.38 x 1.65: PAD 0,0
INDC2012X100N = smd 1.05 x 1.4: 1 -0.95,0; 2 0.95,0
CL-340 = smd 0.5 x 0.5: P$1 0.95,0.45; P$2 0,0.95; P$3 -0.95,0.45; P$4 -0.95,-0.45; P$5 0,-0.95; P$6 0.95,-0.45
CL-196 = smd 0.8 x 0.8: P$A 0,-0.75; P$C 0,0.75
EXB-38V,28V = smd 0.65 x 0.55: P$1 -1.275,0.725; P$4 1.275,0.725; P$5 1.275,-0.725; P$8 -1.275,-0.725 | smd 0.45 x 0.55: P$2 -0.475,0.725; P$3 0.475,0.725; P$6 0.475,-0.725; P$7 -0.475,-0.725
220AMA16R = smd 3 x 1: 1 -3.525,2.54; 2 -3.525,0; 3 -3.525,-2.54; 4 3.975,-2.54; 5 3.975,0; 6 3.975,2.54
CVS-02B = smd 0.7 x 0.7: CASE1 -1.45,2.15; CASE2 1.45,2.15; CASE3 -1.45,-2.15; CASE4 1.45,-2.15 | smd 0.5 x 1.2: P$1-1 -0.5,-2.95; P$1-2 -0.5,2.95; P$2-1 0.5,-2.95; P$2-2 0.5,2.95
EVQ = smd 2 x 1.6: P$1 -2.7,0; P$2 2.7,0
3314J-1 = smd 1.3 x 2: P$1 -1.15,2; P$3 1.15,2 | smd 2 x 2: P$2 0,-2
HCM49 = smd 5.5 x 1.5: P$1 0,0; P$2 8.5,0

### Placement (x,y rotation side)
0R1  37.75,22.9 270 bottom
0R2  40.4,22.9 270 bottom
C1  20.59,51.87 135 top
C2  19.11,50.39 135 top
C3  41.92,52.24 135 top
C4  36.96,56.99 315 top
C5  7.22,16.5 0 top
C6  29.1,39.3 270 bottom
C7  20.3,40 270 bottom
C8  30.35,36.32 135 bottom
CN1  26.93,8.67 0 top
CN2  46.75,8.7 0 top
CN3  53.9,9.85 0 top
CN4  69.7,38.15 90 top
CN5  69.7,52.6 90 top
CN6  68,25.7 180 top
CN7  67.8,13.5 180 top
CN8  23.4,57.5 0 top
CN9  42.55,17.35 0 top
CN10  5.92,8 0 top
CR1  18.76,41.13 225 bottom
CR2  30.79,41.27 315 bottom
CR3  24.94,46.93 45 bottom
CR4  26.52,32.68 225 bottom
CR5  14.6,17.27 0 top
CR6  52.3,51.5 90 top
CR7  45.9,51.5 90 top
CR8  45.9,57 90 top
CR9  21.78,33.46 135 bottom
CR10  52.3,57 90 top
CR11  49.1,57 90 top
CR12  49.1,51.5 90 top
DC1  28.81,34.06 135 bottom
DC2  23.31,31.69 45 bottom
DC3  20.54,43.1 315 bottom
DC4  23.04,45.58 135 bottom
DC5  29.19,43.12 45 bottom
DC6  16.71,30.46 225 top
DC7  14.28,32.82 225 top
DC8  52.9,19.75 180 top
DC9  58.7,34.15 90 top
DC10  58.75,48.85 90 top
DC11  65.45,33.9 0 top
DC12  65.55,48.4 0 top
DC13  63.21,20.16 0 top
DC14  63.6,8.2 0 top
DC15  45.92,23.5 90 top
DC-DC1  24.85,38.76 0 bottom
IC1  24.86,38.79 45 top
IC2  54.25,16.9 180 top
IC3  61.4,41.4 180 top
IC4  61.45,56.25 180 top
IC5  43.45,23.5 180 top
L1  14.09,26.22 135 top
LED1  39.4,61.2 0 top
LED2  43,61.2 0 top
LED3  14.6,20.12 270 top
R1  29,50.73 45 top
R2  11.55,41.7 180 top
R3  26.1,43.65 270 bottom
R4  52.4,13.55 180 top
R5  52.4,14.4 180 top
R6  14.5,59.25 180 top
R7  14.5,61.65 180 top
R8  43.73,20.8 180 top
RA1  13.7,49.05 270 top
S2  6.85,48.5 90 top
SW1  6.95,57.9 90 top
SW2  6.7,38.8 0 top
VR1  6.65,30.27 90 top
VR2  6.62,24.35 90 top
XTAL1  39.72,47.41 135 top

### Tracks (layer width: path | path; a pad name or v marks a point on that pad's centre or on a via)
1_A1
  Top 0.152: CN4.P$5 67.23,36.95 IC3.1
1_A2
  Top 0.152: CN4.P$6 69.67,39.45 67.8,39.45 66.6,38.25 64.14,38.25 IC3.2
1_B1
  Top 0.152: IC3.6 65.59,43.31 65.9,43 65.9,42.05 67.26,40.69 CN4.P$7
1_B2
  Top 0.152: CN4.P$8 69.66,42 67.5,42 66.55,42.95 66.55,44.1 66.08,44.58 IC3.7
1_I1  (via drill 0.35)
  Top 0.152: v60.8,44.55 58.71,44.55 IC3.10
  Bottom 0.2: CN4.P$9 67.11,44.55 v60.8,44.55
1_I2  (via drill 0.35)
  Top 0.152: v60.8,45.85 IC3.9
  Bottom 0.2: CN4.P$10 68.35,45.85 v60.8,45.85
1U_H  (via drill 0.35)
  Top 0.152: IC1.P$22 35.8,34.21 v35.8,32.7
  Route3 0.152: CN1.P$7 19.9,9.7 19.9,16.8 v35.8,32.7
1U_L  (via drill 0.35)
  Top 0.152: IC1.P$23 36.6,34.11 v36.6,33.35 36.6,33.3
  Route3 0.152: v36.6,33.35 36.6,32.64 35.16,31.2 34.8,31.2 20.93,17.33 CN1.P$8
1V_H  (via drill 0.35)
  Top 0.152: IC1.P$24 37.45,33.97 v37.45,32.7 | CN1.P$3 24,9.6 24,18.8 v29.05,23.7
  Bottom 0.152: v29.05,23.7 37.45,32.25 v37.45,32.7
1V_L  (via drill 0.35)
  Top 0.152: IC1.P$25 38.25,33.88 v38.25,33.95 | CN1.P$4 25.35,11.1 25.35,19.05 v31.4,25.1
  Bottom 0.152: v31.4,25.1 38.25,31.8 v38.25,33.95
1W_H  (via drill 0.35)
  Top 0.152: IC1.P$26 35.62,40.06 v36.2,39.48 | CN1.P$5 21.95,9.65 21.95,21.2 v24.75,24.05
  Route3 0.2: v24.75,24.05 24.75,24.55 36.2,36 v36.2,39.48
1W_L  (via drill 0.35)
  Top 0.152: IC1.P$27 34.43,40.41 34.84,40.82 36.13,40.82 v37.45,39.5 | CN1.P$6 22.93,20.83 v24.25,22.15
  Route3 0.152: v37.45,39.5 37.45,35.35 v24.25,22.15
2_A1
  Top 0.152: CN5.P$5 67.64,51.81 IC4.1
2_A2
  Top 0.152: IC4.2 63.42,53.08 62.55,52.2 62.55,51.3 63,50.85 69.22,50.85 CN5.P$6
2_B1
  Top 0.152: CN5.P$7 67.2,56.37 67.2,57.3 66.34,58.16 IC4.6
2_B2
  Top 0.152: CN5.P$8 70.05,56.06 70.05,58.4 69.03,59.42 IC4.7
2U_H  (via drill 0.35)
  Top 0.152: IC1.P$37 32.39,45.61 34.59,45.61 v35.05,45.15
  Route3 0.152: v35.05,45.15 39,41.2 39,19.7 39.88,18.83 39.88,9.58 CN2.P$7
2U_L  (via drill 0.35)
  Top 0.152: v33.6,46.3 32.37,46.3 IC1.P$38
  Route3 0.152: CN2.P$8 40.75,15 40.25,15.5 40.25,19.2 39.55,19.9 39.55,41.7 34.95,46.3 v33.6,46.3
2V_H  (via drill 0.35)
  Top 0.152: IC1.P$39 32.76,47.4 v33.25,47.4
  Route2 0.152: v33.25,47.4 34.3,47.4 39.1,42.6 39.1,29.8 37.15,27.85 37.15,12.35 37.75,11.75 37.75,10.35 38.45,9.65 43.8,9.65 CN2.P$3
2V_L  (via drill 0.2)
  Top 0.152: v31.9,48.25 31.49,48.25 IC1.P$42
  Route2 0.152: CN2.P$4 43.45,12 38.3,12 37.62,12.67 37.62,27.52 39.65,29.55 39.65,42.7 34.1,48.25 v31.9,48.25
2W_H  (via drill 0.2)
  Top 0.152: v32.6,48.85 32.55,48.9 31.43,48.9 IC1.P$43
  Route3 0.152: CN2.P$5 42.75,9.35 41.8,10.3 41.8,11.88 42.4,12.48 42.4,18.38 40.1,20.67 40.1,42.05 33.3,48.85 v32.6,48.85
2W_L  (via drill 0.35)
  Top 0.152: IC1.P$44 31.48,49.65 v33.15,49.65
  Route3 0.152: v33.15,49.65 33.2,49.65 40.65,42.2 40.65,20.7 42.75,18.6 CN2.P$6
+5V  (via drill 0.2, 0.35)
  Top 0.152: DC10.P$1 58.66,47.94
  Top 0.2: 17.82,57.8 18.2,58.17 18.55,58.17
  Top 0.254: DC8.P$2 51.35,19.75 v51.3,19.8 | DC15.P$2 45.9,24.02 v45.9,24.8
  Top 0.406: 41.25,62.15 v41.25,61.35
  Top 0.508: DC11.P$1 63.7,33.15 DC9.P$1 | 58.76,33.09 DC9.P$1 | DC12.P$1 v63.7,48.4 | DC10.P$1 58.75,47.05 v58.7,47 | DC14.P$1 v61.7,8.2 | DC13.P$1 61.36,20.16 v61.3,20.1 | DC9.P$1 58.15,33.15 v57.1,32.1 | RA1.P$4 RA1.P$3 RA1.P$2 RA1.P$1 14.43,51.78 v14.15,52.05 | R7.P$1 R6.P$1 14.5,58.4 | 15.1,57.8 17.82,57.8 18.1,57.8 CN8.P$1 | 14.5,58.4 15.1,57.8 | 14.5,58.4 14.5,57.3 | 14.5,57.3 v14.5,56.85 | 15.1,57.8 15,57.8 14.5,57.3 | L1.1 15.27,25.05 v15.85,25.05 | LED3.P$A 12.72,20.12 v12.7,20.15 | 42.55,62.15 LED2.P$2 43.45,62.15 LED2.P$1 | 42.55,62.15 41.25,62.15 39.85,62.15 | 39.85,62.15 LED1.P$2 38.95,62.15 LED1.P$3 | LED1.P$1 39.85,62.15 | LED2.P$3 42.55,62.15
  Route3 0.406: v41.25,61.35 41.3,61.85 41.2,61.75 41.3,61.95
  Bottom 0.152: 12.55,40.7 v12.5,40.7
  Bottom 0.2: 0R2.P$2 40.4,24.5 v41.9,26
  Bottom 0.254: v25.75,34.05 26.02,34.05 26.52,33.55 | CR3.P$1 25.4,46.47 v25.4,46 | CR2.P$1 31.96,40.1 v32,40.1 | 21.7,40.95 v21.7,40.65
  Bottom 0.305: DC3.P$2 19.83,42.2 CR1.P$1 17.79,40.16 v17.74,40.16 | 24,46.28 DC4.P$2 24.3,46.28 CR3.P$1 | DC2.P$2 22.61,32.63 CR9.P$1 21.19,34.05 v21.05,34.05 | CR2.P$1 29.89,42.17 DC5.P$1 | CR4.P$1 27.19,33.35 DC1.P$1 | 26.52,33.55 26.52,33.7 26.52,34.02 25.78,34.02 v25.75,34.05
  Bottom 0.508: 29.14,36.32 28.5,36.32 28.5,35.68 | 29.14,36.32 C8.P$1 | 27.01,34.19 26.52,33.7 CR4.P$1 27.01,33.17 27.01,34.19 | 27.01,34.19 28.5,35.68 | 28.5,35.68 29.14,36.32 | v12.5,40.7 12.5,40.3 16.5,36.3
  Bottom 0.61: DC-DC1.C1 DC-DC1.D1 | DC-DC1.D2 DC-DC1.D1 | DC-DC1.D1 DC-DC1.E1 | DC-DC1.E1 22.31,41 | 22.31,41 DC-DC1.E2 | DC-DC1.E2 DC-DC1.D2 | DC-DC1.D2 v22.98,40.63 22.62,41 22.31,41 | DC-DC1.E2 DC-DC1.D1 | DC-DC1.D2 arc-90 DC-DC1.C1 | DC-DC1.C1 24.85,41.6 arc90 v24.4,42.05 | v24.4,42.05 23.55,42.05 | 23.55,42.05 v22.75,42.05 | v22.75,42.05 22.25,42.05 | 22.25,42.05 22,42.05 arc90 21.7,41.75 21.7,41.4 21.7,40.95 | v21.7,40.65 arc90 DC-DC1.E2 | DC-DC1.E1 22.31,41.99 arc90 22.25,42.05 | DC-DC1.E1 23.66,41.31 arc90 v24.4,42.05 | DC-DC1.C1 24.3,41.31 arc-90 23.55,42.05 | DC-DC1.D1 23.5,41.31 arc-90 v22.75,42.05 | DC-DC1.E1 22.8,41.31 arc90 23.55,42.05
  Bottom 0.813: C7.P$1 22.27,40 DC-DC1.E2 | C7.P$1 21.7,41.4 | C7.P$1 20.95,40.65 v21.7,40.65
  other vias: 30.35,36.32
  pour Route3 (isolate 0.305): -2,69 84,69 84,-4 -5,-4 -5,69
A*
  Top 0.152: CN9.3 43.8,19.12 43.16,19.77 R8.P$2
  Top 0.2: IC5.P$6 43.2,20.84 R8.P$2
AGND  (via drill 0.35)
  Top 0.305: v23.36,31.74 23.36,30.93 IC1.P$97
  Bottom 0.305: DC2.GND2 v23.36,31.74 DC2.GND1 23.76,32.4 CR9.P$2
AVDD  (2 unrouted)
  Top 0.2: VR1.P$1 4.65,27.42 5.18,26.9 6.21,26.9 | 6.58,26.52 6.58,23.73 6.05,23.2 VR2.P$1 | 6.58,26.52 6.58,26.84 6.62,26.9 | L1.2 6.95,26.9 | 6.95,26.9 6.62,26.9 | 6.62,26.9 6.21,26.9 | 6.95,26.9 6.78,26.72 | 6.78,26.72 6.58,26.52 | 6.58,26.52 6.34,26.76 | 6.34,26.76 6.21,26.9 | 6.34,26.76 6.74,26.76 6.78,26.72
  Top 0.254: L1.2 13.42,27.18 14.91,28.66 | 14.91,28.66 15.27,29.03 | 15.27,29.03 15.51,29.27 | 15.51,29.27 DC6.P$2 | DC7.P$2 13.25,31.78 13.25,30.92 14.91,29.27 | 14.91,29.27 14.91,28.66 | 14.91,29.27 15.15,29.03 15.27,29.03 | 14.91,29.27 15.51,29.27
B*
  Top 0.152: R8.P$1 43.73,19.95 46.3,17.38 CN9.4
  Top 0.2: 43.73,22.08 IC5.P$7 43.7,20.83 R8.P$1
CANH  (via drill 0.2)
  Top 0.152: CN3.P$1 55.9,9.74 55.9,13 54.6,14.3 54.6,15.33 IC2.P$7 | R4.P$1 52.84,13.55 v53.39,13
  Bottom 0.2: CN3.P$1 55.9,9.74 55.9,11.55 54.45,13 v53.39,13
CANL
  Top 0.152: CN3.P$3 53.92,9.77 53.92,13.5 | 53.92,13.5 IC2.P$6 | R5.P$1 53.02,14.4 53.92,13.5
CU1_1
  Top 0.152: IC1.P$96 18.7,26.98 18.7,13.6 17.95,12.85 17.95,10.49 17.11,9.65 13.9,9.65 CN1.P$15
CU1_2
  Top 0.152: IC1.P$95 17.9,26.88 17.9,13.65 CN1.P$14
CU1_3  (via drill 0.35)
  Top 0.152: v17.1,15.3 17.1,26.79 IC1.P$94
  Bottom 0.152: v17.1,15.3 17.1,12.5 15.95,11.35 15.95,9.7 CN1.P$13
CU2_1  (via drill 0.2)
  Top 0.2: v30.6,14.55 31.2,13.95 31.2,9.35 31.85,8.7 CN2.P$15 | IC1.P$85 17.6,33.65 v17.6,32.8
  Bottom 0.2: v30.6,14.55 16.65,28.5 16.68,31.25 17.6,32.17 v17.6,32.8
CU2_2  (via drill 0.2)
  Top 0.152: IC1.P$84 15.7,32.46 v15.7,31.1
  Bottom 0.2: v15.7,31.1 15.7,28.3 30.3,13.7 33.95,13.7 34.75,12.9 CN2.P$14
CU2_3  (via drill 0.2)
  Top 0.203: IC1.P$83 14.8,32.27 v14.8,31.8
  Bottom 0.2: v14.8,31.8 14.8,28.05 29.95,12.9 32.95,12.9 33.8,12.05 33.8,9.65 CN2.P$13
CVR1  (via drill 0.2)
  Top 0.152: IC1.P$100 23.58,27.63 v23.1,27.15 | 8.69,24.05 VR2.P$2
  Top 0.2: IC1.P$100 | v10.5,23.1 9.64,23.1 8.69,24.05
  Route3 0.152: v23.1,27.15 19.05,23.1 v10.5,23.1
CVR2  (via drill 0.2)
  Top 0.152: IC1.P$99 22.05,28.2 v22.05,27.15 | v10.72,27.83 10.05,27.83 8.81,29.06
  Top 0.2: 8.81,29.06 VR1.P$2
  Route3 0.152: v22.05,27.15 22.05,26.75 18.81,23.51 13.94,23.51 12.5,24.95 12.5,27.5 12.18,27.83 v10.72,27.83
DIP1  (via drill 0.2)
  Top 0.152: 11.57,47.78 v11.55,47.75 | IC1.P$80 15.31,34.9 11.2,34.9 10.2,35.9 7.9,35.9
  Top 0.2: RA1.P$5 11.57,47.78 | S2.1 4.31,42.09 6.5,39.9 | 7.9,35.9 6.5,37.3 6.5,39.9 | 6.5,39.9 v6.5,41.75
  Bottom 0.2: v11.55,47.75 7.9,47.75 6.5,46.35 v6.5,41.75
DIP2
  Top 0.2: IC1.P$79 15.01,35.3 11.35,35.3 10.35,36.3 8.5,36.3 7.3,37.5 7.3,41.2 8.15,42.05 8.15,47.6 9.39,48.84 S2.4 9.43,52.47 11.57,50.33 RA1.P$8
DIP4
  Top 0.152: RA1.P$6 10.28,48.58 9.39,47.69 S2.3 | IC1.P$78 14.7,35.7 11.5,35.7 10.5,36.7 8.9,36.7
  Top 0.2: S2.3 9.39,42.54 7.9,41.05 7.9,37.7 8.9,36.7
DIP8  (via drill 0.2, 0.35)
  Top 0.152: S2.6 4.63,52.8 v5.55,52.8 | RA1.P$7
  Top 0.2: IC1.P$77 14.44,36.15 12.1,36.15 v11.35,36.9 | RA1.P$7 v11.55,49.52
  Route3 0.152: v11.35,36.9 10.7,37.55 10.7,48.67 v11.55,49.52
  Bottom 0.2: v5.55,52.8 8.83,49.52 v11.55,49.52
ENC_A-1  (via drill 0.35)
  Top 0.152: IC1.P$30 33.9,42.17 56.93,42.17 57.7,41.4 61.27,41.4 v62.27,40.4 62.3,40.37 62.3,40.15 62.95,39.5 IC3.3
  Bottom 0.2: v62.27,40.4 62.27,30.43 65,27.7 CN6.P$1
ENC_A-2
  Top 0.152: 22.91,48.51 IC1.P$52 | 61.7,54.95 62.3,54.34 IC4.3
  Top 0.2: CN7.P$1 64.8,16.7 69.6,21.5 69.6,29.4 72.7,32.5 72.7,52.5 71.79,53.41 68.1,53.41 68.09,53.4 66.75,53.4 65.81,54.34 IC4.3 | 22.91,48.51 22.8,48.62 22.8,49.1 23.7,50 25.75,50 38.41,62.66 43.66,62.66 43.67,62.65 50.25,62.65 53.8,59.1 53.8,56.3 55.15,54.95 61.7,54.95
ENC_B-1  (via drill 0.2)
  Top 0.152: IC1.P$31 33.72,42.7 60.1,42.7 60.8,42 v62.7,42 64.08,42 IC3.5
  Bottom 0.2: v62.7,42 63.1,41.6 63.1,30.8 64.8,29.1 67.6,29.1 68,28.7 CN6.P$2
ENC_B-2
  Top 0.152: IC4.5 62.31,56.89 62.3,56.9
  Top 0.2: 62.3,56.9 62.3,56.95 61.7,57.55 55.9,57.55 50.44,63.01 38.26,63.01 25.6,50.35 23.1,50.35 22.3,49.55 22.3,48.41 IC1.P$53 | IC4.5 65.37,56.89 65.95,56.3 65.95,55.4 67.15,54.2 72.3,54.2 74.25,52.25 74.25,27.65 72.3,25.7 72.3,19.5 CN7.P$2
ENC_Z-1  (via drill 0.2)
  Top 0.152: IC1.P$32 33.62,43.31 v57,43.31 IC3.11
  Top 0.2: v57,43.31
  Route3 0.2: v57.01,43.3 v57,43.31
  Bottom 0.2: v57,43.31 62.79,43.31 63.9,42.2 63.9,31.15 65.2,29.85 69.7,29.85 71,28.55 CN6.P$3
ENC_Z-2  (via drill 0.2)
  Top 0.152: IC4.11 56.15,58.16 v54.3,60 | CN7.P$3 75.2,15 76.2,16 76.2,55.7 69.45,62.45 51.85,62.45 51.73,62.58
  Top 0.2: v54.3,60 51.73,62.58 50.9,63.4 38,63.4 25.4,50.8 22.8,50.8 21.83,49.83 21.83,48.18 IC1.P$54
GND  (via drill 0.2, 0.35)  (4 unrouted)
  Top 0.152: v13.95,34.3 14.32,33.92
  Top 0.2: IC2.P$9 54.58,17.23 IC2.P$2 54.58,19.58 v54.6,19.6 | SW1.P$1-2 SW1.P$2-2 4.5,58.4 v6.85,56.05 S2.5 | DC7.P$3 13.76,33.34 13.76,33.36 | 52.9,19.52 DC8.P$4 v52.9,20.8 | IC5.PAD DC15.P$3 DC15.P$4 v47,23.5 | VR2.P$3 3.42,25.5 2.9,26.02 v2.9,27.35 2.9,31.2 3.35,31.65 4.42,31.65 VR1.P$3 4.92,31.7 | S2.2 5.45,46.38 v5.45,47.75 | DC6.P$4 DC6.P$3 17.23,29.95 v17.65,29.95
  Top 0.203: IC5.P$5 42.7,22.75 IC5.PAD
  Top 0.254: 32.49,35.41 31.6,36.3 31.6,36.8 v31.25,37.15
  Top 0.305: 22.45,46.15 22.1,46.5 | 22.1,46.5 IC1.P$56 IC1.P$57 | 22.45,46.15 23.04,45.56 v23.06,45.56 | IC1.P$19 32.49,35.41 | IC1.P$41 28.46,44.51 28.2,44.51 27.39,43.7 v27.35,43.7 | 22.61,46.3 22.59,46.3 | 13.76,33.36 14.32,33.92 14.8,34.4 15.52,34.4 IC1.P$81 v18.32,37.2 19.33,36.18 19.33,36.02 19.35,36 19.35,34.69 IC1.P$86 | IC1.P$57 | IC1.P$57 21.8,46.42 | 21.8,46.42 22.02,46.42 22.1,46.5 | 22.45,46.15 21.74,46.15 IC1.P$57 | CR3.P$2 24.84,47.75 25.6,47.75 26.12,47.22 26.23,47.22 IC1.P$48 | 21.8,46.42 21.25,46.97 21.25,47 | v20.55,43.09 20.55,43.81 IC1.P$62 | 40.8,53.65 C3.P$2 | C2.P$2
  Top 0.406: SW2.P$1 v2.25,38.8
  Top 0.508: 9.8,16.54 C5.P$- | v63.2,18.6 63.21,18.61 DC13.GND2 DC13.GND1 63.21,21.29 v63.2,21.7 | IC4.8 62.95,60.69 v62.3,60.04 | v60.3,48.8 60.25,48.85 DC10.GND2 DC10.GND1 57.35,48.85 v57.1,48.8 | v65.55,50.15 DC12.GND1 DC12.GND2 65.55,47.05 v65.6,47 | IC3.8 63.55,45.84 v62.5,46.9 | v57.1,34.1 57.15,34.15 DC9.GND1 DC9.GND2 60.25,34.15 v60.3,34.1 | v65.4,35.5 65.45,35.45 DC11.GND1 DC11.GND2 65.45,32.35 v65.5,32.3 | v63.6,6.6 DC14.GND2 DC14.GND1 v63.6,9.8 | CR5.P$C 14.57,17.27 v14.6,17.3 | 18.18,52.87 v17.8,53.25 | v17.8,53.25
  Top 0.61: C2.P$2 18.18,52.87 C1.P$2
  Top 1.016: C4.P$2 v39.6,56.8 | C3.P$2 v41.65,54.79 v41.65,54.8
  Route2 0.406: v20.3,36.58 20.3,36.55 | v20.22,41.58 20.15,41.65 | 20.15,41.65
  Route2 0.508: 62.3,60.17 v62.3,60.04 62.3,60
  Bottom 0.152: CR4.P$2 27.86,32.22
  Bottom 0.254: DC5.GND2 28.37,42.68 v27.35,43.7 | v31.25,37.15 32.05,37.95 C8.P$2
  Bottom 0.305: DC1.GND2 DC1.GND1 | DC4.GND2 v23.06,45.56 DC4.GND1 | 28.81,42.74 DC5.GND1 | DC5.GND2 28.81,42.74 | CR2.P$2 28.81,42.33 28.81,42.74 | DC3.GND2 v20.55,43.09 DC3.GND1 | 20.89,42.34 20.3,41.75 CR1.P$2 | 25.7,31.55 26.31,31.55 CR4.P$2
  Bottom 0.406: C7.P$2 v20.3,36.58 | 20.3,41.75 20.3,41.66 v20.22,41.58
  Bottom 0.508: R3.P$1 26.1,44.9 v26.65,45.45 | C6.P$2 v29.1,37.75
  Bottom 0.61: DC-DC1.C3 DC-DC1.B3 DC-DC1.B4 arc90 DC-DC1.C3 | DC-DC1.D3 DC-DC1.E3 arc-90 DC-DC1.D4 | DC-DC1.D3 DC-DC1.C3 | DC-DC1.D3 DC-DC1.D4 | DC-DC1.D4 arc-90 DC-DC1.C3
  Bottom 0.813: DC-DC1.E3 21.46,38.77 C7.P$2
  other vias: 24.48,47.39 43.45,23.5 54.25,16.9 72.65,30.35 68.95,18.6 74.15,18.45 42.7,40.4 42.6,35 45.45,61.75 49.45,61.75 54.3,61.75 61.45,56.3 56.75,59.1 55,56.7 24.7,16.5 24.75,12.65 61.3,53.1 24.85,44 13.75,29 9.9,35.05 4.85,37.3 5.2,42.75 7.35,42.75 17.05,56.7 30.85,53.95 26.85,49.9 24.2,49.2 43.5,55.5 43.3,44.1 49.3,44.1 49.25,47.25 57.15,54.1 53.6,55.2 51.85,57.3 51.3,60 49.7,60.05 46,29.4 49.15,40.95 56.55,40.95 50.6,14.75 43.8,64.4 54.7,64.4 8.25,63.85 2.1,59.45 17.15,2.5 34.8,2.5 69.75,2.6 77.15,9.65 77.65,57.55 77.75,29 20.3,19.95 44.8,20.75 21.6,28.8 36.8,59.45 60.55,40.4 73.45,41.65 73.5,51.3 75.25,36.5 75.2,54.9 66.05,61.65 22.9,38.7 23.6,38.15 24.25,38.75 26.1,38.15 25.5,38.75
  pour Route2 (isolate 0.254): -7,71 87,71 87,-5 -7,-5
  pour Bottom (isolate 0.305): 0,67 81,67 81,-2 -2,-2 -2,67
  pour Top (isolate 0.254): -8.6,72.8 89.3,72.8 89.3,-6.85 -8.75,-6.85 -8.75,73.05
LED1_1  (via drill 0.2)
  Top 0.2: IC1.P$12 33.47,29.47 44.74,29.47 47.98,32.7 v47.98,41.45 | CR6.P$C 52.3,49.05 v51.7,48.45
  Bottom 0.2: v47.98,41.45 47.98,47.3 49.12,48.45 v51.7,48.45
LED1_2  (via drill 0.2)
  Top 0.2: 49.2,49.77 CR12.P$C 49.1,49.35 v48.6,48.85 | v47.4,39.4 47.4,32.9 44.5,30 33.64,30 IC1.P$13
  Bottom 0.2: v48.6,48.85 47.4,47.65 v47.4,39.4
LED1_3  (via drill 0.2)
  Top 0.2: IC1.P$15 34.45,30.6 44.33,30.6 46.83,33.1 v46.83,41.45 | v46.83,48.22 46.83,48.94 CR7.P$C
  Bottom 0.2: v46.83,41.45 v46.83,48.22
LED2_1  (via drill 0.2)
  Top 0.2: IC1.P$16 34.68,31.08 43.45,31.08 45.7,33.33 v45.7,39.4 | v51.36,54.35 52.3,55.29 CR10.P$C
  Bottom 0.2: v51.36,54.35 50.56,53.55 46.6,53.55 45.75,52.7 45.75,39.45 v45.7,39.4
LED2_2  (via drill 0.2)
  Top 0.2: IC1.P$17 34.91,31.56 43.1,31.56 45.05,33.51 v45.05,41.45 | v48.3,54.42 49.1,55.22 CR11.P$C
  Bottom 0.2: v48.3,54.42 46.48,54.42 45.05,53 v45.05,41.45
LED2_3  (via drill 0.2)
  Top 0.2: IC1.P$18 35.16,32.01 42.5,32.01 44.35,33.86 v44.35,39.4 | v45.1,54.58 CR8.P$C
  Bottom 0.2: v45.1,54.58 44.35,53.83 v44.35,39.4
N$1  (via drill 0.35)
  Top 0.305: DC5.P$2 IC1.P$40
  other vias: 28.48,43.83
N$2  (via drill 0.2)
  Top 0.305: DC4.P$1 21.13,46.07 IC1.P$58
  other vias: 22.33,44.87
N$3  (via drill 0.2)
  Top 0.305: DC3.P$1 IC1.P$61 | IC1.P$61 | IC1.P$61
  other vias: 21.24,43.81
N$4  (via drill 0.2)
  Top 0.152: IC1.P$98 23.05,29.73 23.45,30.14 24.34,30.14 arc90 v24.6,30.4
  Bottom 0.152: DC2.P$1 v24.6,30.41 v24.6,30.4
N$5  (via drill 0.2)
  Top 0.305: IC1.P$14 29.58,34.77 DC1.P$2
  other vias: 29.52,34.77
N$6
  Top 0.2: 53.9,18.48 IC2.P$3 53.92,19.48 53.65,19.75 DC8.P$1
N$7
  Bottom 0.508: DC-DC1.B1 26.12,42.88 R3.P$2
N$8
  Top 0.305: 20.59,51.86 C1.P$1 20.59,48.71 IC1.P$55
N$9
  Top 0.305: 20.39,45.36 IC1.P$60 19.11,46.66 C2.P$1
N$11
  Top 0.305: 32.91,54.09 32.61,54.34 R1.P$2 | 32.91,54.09 XTAL1.P$2 | C4.P$1 33.96,54.09 32.91,54.09
N$12
  Bottom 0.508: DC-DC1.A2 29.09,40.03 C6.P$1
N$14
  Top 0.2: IC1.P$87 18.35,32.99 18.35,32.11 DC6.P$1
N$15
  Top 0.2: IC1.P$82 15.53,33.7 15.1,33.7 14.64,33.24 DC7.P$1
N$18  (via drill 0.2)
  Top 0.2: CN8.P$5 22.4,56.5 v20.5,54.6 | v16.66,48.5 16.66,44.16 IC1.P$67
  Route3 0.2: v16.66,48.5 16.6,48.56 16.6,50.7 v20.5,54.6
N$19
  Top 0.2: CN8.P$6 23.4,56.4 20.85,53.85 20.75,53.85 20.5,53.85 17.21,50.56 17.21,44.31 IC1.P$66 17.8,43.72
N$20  (via drill 0.2)  (1 unrouted)
  Top 0.2: IC1.P$63 19.34,44.44 18.91,44.87 18.91,45.79 v18.9,45.8 | v26.4,54.8 CN8.P$9
  Route3 0.2: 24,52.4 v26.4,54.8 | v18.9,45.8 18.9,49.19 22.16,52.45 23.95,52.45
N$21
  Top 0.2: IC1.P$65 17.77,44.46 17.77,50.37 20.9,53.5 21.4,53.5 24.4,56.5 CN8.P$7
N$22  (via drill 0.2)
  Top 0.2: IC1.P$64 18.32,44.61 v18.32,47.6 | v23.5,54.5 25.4,56.4 CN8.P$8
  Route3 0.2: v18.32,47.6 18.32,49.32 v23.5,54.5
N$23
  Top 0.2: CN8.P$4 21.4,56.5 19.6,54.7 18.05,54.7 16.1,52.75 16.1,44.01 IC1.P$68
N$24
  Top 0.2: IC1.P$69 15.6,43.8 15.6,53.3 17.5,55.2 19.3,55.2 20.4,56.3 CN8.P$3
N$25
  Top 0.2: CN8.P$2 19.4,56.2 18.9,55.7 16.85,55.7 15.1,53.95 15.1,43.6 IC1.P$70
N$28
  Top 0.152: IC4.16 58.74,49.86 DC10.P$2
N$29
  Top 0.152: DC9.P$2 58.7,36.94 IC3.16
N$30
  Top 0.508: DC12.P$2 66.95,48.8 69.69,48.8 CN5.P$2
N$31
  Top 0.508: DC11.P$2 66.95,34.4 69.7,34.4 70.97,33.13 CN4.P$2
N$32
  Top 0.508: CN6.P$5 68,22 66.16,20.16 DC13.P$2
N$33
  Top 0.508: DC14.P$2 67,8.2 67.8,9 CN7.P$5
N$34
  Top 0.508: LED3.P$C 16.23,19.24 CR5.P$A
N$35
  Top 0.152: CN5.P$9 67.36,58.75 59.41,58.75 IC4.10
N$36  (via drill 0.35)
  Top 0.152: v60.7,60.65 58.78,60.65 IC4.9
  Bottom 0.2: v60.7,60.65 62.02,60.65 62.04,60.67 67.98,60.67 CN5.P$10
N$37
  Top 0.2: LED1.P$4 38.45,59.55 41.6,56.4 43.7,56.4 44.4,55.7 44.4,53.8 45.06,53.14 CR7.P$A
N$38
  Top 0.2: LED1.P$5 39.85,60.25 40.5,59.6 40.5,58.7 42.1,57.1 46.9,57.1 47.7,56.3 47.7,53.9 48.47,53.14 CR12.P$A
N$39
  Top 0.2: LED1.P$6 41.3,59.8 41.3,58.9 42.5,57.7 49.9,57.7 50.8,56.8 50.8,53.6 51.4,53 52.16,53 CR6.P$A
N$40
  Top 0.2: LED2.P$4 42.05,59.25 42.7,58.6 45.87,58.6 CR8.P$A
N$41
  Top 0.2: LED2.P$5 43.25,60 48.6,60 49.1,59.5 CR11.P$A
N$42
  Top 0.2: LED2.P$6 51.55,60.75 52.3,60 CR10.P$A
N$43
  Top 0.2: IC5.P$8 45.55,22.1 45.92,22.48 DC15.P$1
N$44
  Bottom 0.406: CN9.2 40.4,18.25 0R2.P$1
N$45
  Bottom 0.305: DC-DC1.C4 24.2,36.85 22.96,36.85 DC-DC1.E4
N$46
  Bottom 0.406: CN9.1 37.73,18.42 0R1.P$1
RESET  (via drill 0.2, 0.35)
  Top 0.2: IC1.P$59 20,46.47 20,47.1 v20.2,47.3 | v24.32,51.43 27.4,54.51 CN8.P$10 | 9.9,41.9 10.1,42.1 | 10.1,42.1 11.1,43.1 11.1,45.3 v12.1,46.3 | R2.P$2 10.15,41.7 | 10.15,41.7 10.1,41.7 | 10.1,41.7 9.9,41.9 | 9.9,41.9 9.7,41.7 | 9.7,41.7 9.55,41.55 | 9.55,41.55 9.4,41.4 SW2.P$2 | 9.95,41.7 9.7,41.7 | 10.1,41.7 10.1,42.1 | 10.15,41.7 10,41.55 9.55,41.55
  Top 0.508: R2.P$2 10.1,41.7 9.95,41.7
  Route3 0.2: v20.2,47.3 v24.32,51.42 v24.32,51.43
  Bottom 0.2: v20.2,47.3 18.81,47.3 18.55,47.04 12.84,47.04 v12.1,46.3
RS_DIR  (via drill 0.35)
  Top 0.2: v43.5,25.8 43.5,25.2 | 43.5,25.2 43.5,25.1 | 43.5,25.1 IC5.P$2 43.3,24.9 | 43.3,24.9 IC5.P$3 43.5,25.2 | 43.5,25.1 43.3,24.9 | v41.46,26.84 33.27,26.84 IC1.P$8
  Bottom 0.2: v41.46,26.84 42.56,26.84 43.5,25.9 v43.5,25.8
RX0  (via drill 0.2)
  Top 0.152: IC1.P$11 29.66,32.53 29.8,32.4 33.65,28.55
  Top 0.2: 52.3,18.45 IC2.P$4 50.55,18.45 49.7,19.3 49.7,27.8 49,28.5 v48.95,28.5 33.7,28.5 29.8,32.4 | v44.4,26.95 44.35,26.9 44.3,26.95 43,26.95 42.7,26.65 IC5.P$4
  Bottom 0.2: v44.4,26.95 47.4,26.95 v48.95,28.5
SPLT  (via drill 0.2)
  Top 0.152: 53.18,15.35 IC2.P$5 53.23,15.3 52.3,15.3 51.83,14.83 R5.P$2 R4.P$2 51.83,12.97 v52.1,12.7
  Bottom 0.2: v52.1,12.7 53.21,11.59 53.23,11.59 54.12,10.71 CN3.P$2
STBY
  Top 0.152: 55.23,15.6 IC2.P$8
  Top 0.2: 55.23,15.6 55.23,15.67 54.95,15.95 49.55,15.95 48.7,16.8 48.7,26.8 47.99,27.51 33.31,27.51 IC1.P$9
SW1  (via drill 0.35)
  Top 0.2: SW1.P$1-1 v11.15,57.4 12.4,57.4 13,58 R6.P$2 | IC1.P$76 13.25,39.36 v13.25,42.75
  Route3 0.2: v13.25,42.75 13.25,50.4 11.95,51.7 11.95,56.6 v11.15,57.4
SW2  (via drill 0.35)
  Top 0.2: SW1.P$2-1 10.9,58.4 v11.85,58.4 11.85,60.5 R7.P$2 | IC1.P$75 13.95,41.21 v13.95,43.5
  Route3 0.2: v13.95,43.5 13.95,50.45 12.5,51.9 12.5,57.75 v11.85,58.4
TX0  (via drill 0.2)
  Top 0.152: v56.7,17.6 56.7,18.1 56.3,18.5 55.27,18.5 IC2.P$1
  Top 0.2: IC1.P$10 33.52,28 48.5,28 49.2,27.3 | v50.6,16.7 49.2,18.1 49.2,27.3 | 49.2,27.3 v49.14,27.3 | v45.05,26.3 44.6,26.3 44.2,25.9 IC5.P$1
  Route3 0.152: v56.7,17.6 56.7,17.1 56.3,16.7 v50.6,16.7
  Bottom 0.2: v45.05,26.3 48.14,26.3 v49.14,27.3
VCC
  Top 0.152: R2.P$1 12.3,41.15 12.5,40.95
VDD  (via drill 0.2, 0.35)
  Top 0.406: v24.76,35.49 26.49,35.49 28.19,37.19 v28.19,38.75
  Top 1.27: CN10.1 4.67,15.47 C5.P$+
  Route2 0.508: 23.65,35.49 23.61,35.45 v23.6,35.45
  Route2 1.27: C5.P$+ 4.69,19.28 6.65,21.25 6.65,29.3 12.96,35.49 v22.6,35.49 23.65,35.49 v24.76,35.49
  Bottom 0.406: v28.19,38.75 27.41,38.75 DC-DC1.A3
  Bottom 0.61: DC-DC1.E5 DC-DC1.D5 | DC-DC1.D5 DC-DC1.C5 | DC-DC1.E5 arc-90 22.9,35.64 | 22.9,35.64 22.9,35.5 | 22.9,35.5 arc90 23.58,36.18 DC-DC1.D5 | DC-DC1.C5 arc90 24.25,35.62 24.25,35.56 | 24.25,35.45 arc90 24.85,36.05 DC-DC1.C5 | DC-DC1.D5 arc-90 24.25,35.56 | 24.25,35.56 24.25,35.45 | 24.25,35.45 arc-90 23.58,36.12 DC-DC1.D5 | 22.9,35.64 arc90 23.09,35.45 v23.6,35.45 24.25,35.45 | 22.9,35.5 arc-90 22.31,36.09 DC-DC1.E5
X1
  Top 0.305: IC1.P$47 27.23,47.48 31.5,51.75 32.7,51.75 36.2,48.25 38.56,48.25 39.57,47.52 | XTAL1.P$1 39.57,47.52 | 39.57,47.52 42.52,50.47 42.52,51.64 C3.P$1
X2
  Top 0.305: 26.53,48.19 IC1.P$49 | IC1.P$49 | IC1.P$49 29,50.71 R1.P$1

### Text on the board
tPlace: UESR LED | Prototype Ver.1 | ENC 2 | Adjust of emergency threshold | ENC 1 | Pilot LED | Hall 1 | CAUTION | RS485 | + | It's First version functionally of test board / Have a possibility of a undiscovered fatal malfunction | Hall 2 | Motor 1 | Motor 2 | CAN FD | All Transfer port is not isolated | MAX +20V
bPlace: Designed by Ozawa | It's First version of functionally test board / Have a possibility of a undiscovered fatal malfunction | CAUTION | RS485 Power jumper